# Altium project two_ax_PCB.PrjPcb
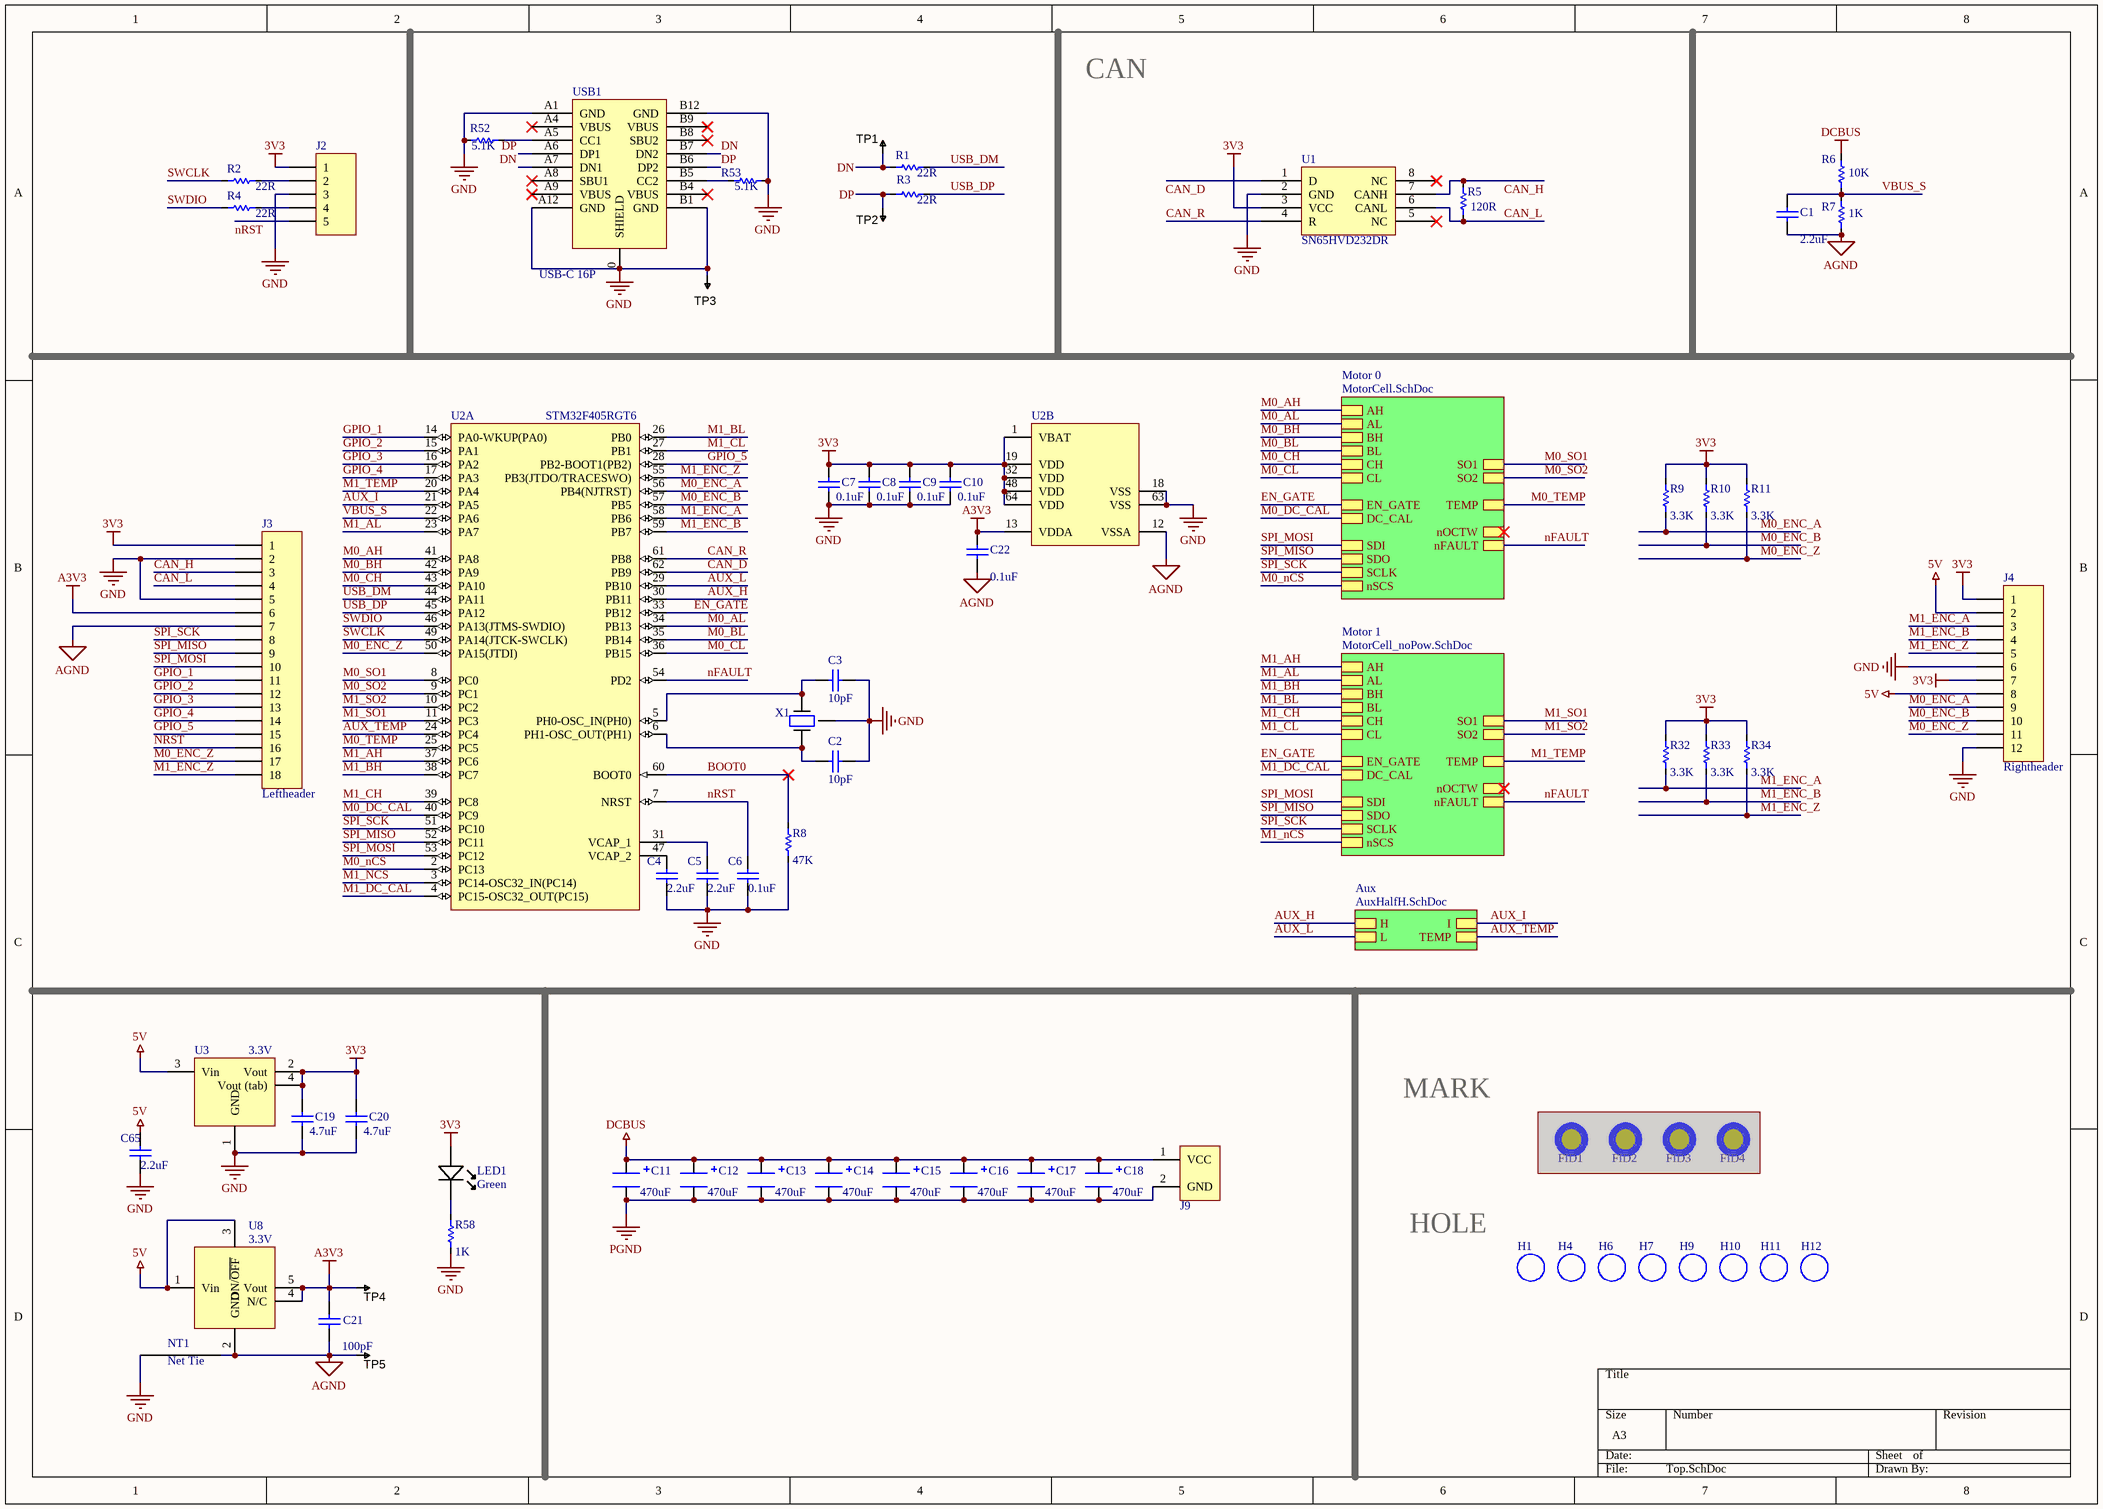
[diagram p0: Top.SchDoc]
4 sheets, 213 parts. Net scope: hierarchical (ports join the sheet entries above them; power ports are global).
Board file: PCB.PcbDoc
Sheets:
  Top.SchDoc
    Motor 0 = MotorCell.SchDoc
    Motor 1 = MotorCell_noPow.SchDoc
    Aux = AuxHalfH.SchDoc

## Sheet Top.SchDoc
size A3; SheetNumber: 1

### Parts
C1  value 2.2uF  [C0603]  (hidden comment: Cap)
C2  value 10pF  [C0603]  (hidden comment: Cap)
C3  value 10pF  [C0603]  (hidden comment: Cap)
C4  value 2.2uF  [C0603]  (hidden comment: Cap)
C5  value 2.2uF  [C0603]  (hidden comment: Cap)
C6  value 0.1uF  [C0603]  (hidden comment: Cap)
C7  value 0.1uF  [C0603]  (hidden comment: Cap)
C8  value 0.1uF  [C0603]  (hidden comment: Cap)
C9  value 0.1uF  [C0603]  (hidden comment: Cap)
C10  value 0.1uF  [C0603]  (hidden comment: Cap)
C11  470uF  [CAP_ELEC_SIZE_G]
C12  470uF  [CAP_ELEC_SIZE_G]
C13  470uF  [CAP_ELEC_SIZE_G]
C14  470uF  [CAP_ELEC_SIZE_G]
C15  470uF  [CAP_ELEC_SIZE_G]
C16  470uF  [CAP_ELEC_SIZE_G]
C17  470uF  [CAP_ELEC_SIZE_G]
C18  470uF  [CAP_ELEC_SIZE_G]
C19  value 4.7uF  [C0805]  (hidden comment: Cap)
C20  value 4.7uF  [C0805]  (hidden comment: Cap)
C21  value 100pF  [C0805]  (hidden comment: Cap)
C22  value 0.1uF  [C0603]  (hidden comment: Cap)
C65  value 2.2uF  [C0603]  (hidden comment: Cap)
FID1  FIDUCIAL  [FIDUCIAL]  (value not drawn)  (masked out: inside a compile mask, not in the netlist)
FID2  FIDUCIAL  [FIDUCIAL]  (value not drawn)  (masked out: inside a compile mask, not in the netlist)
FID3  FIDUCIAL  [FIDUCIAL]  (value not drawn)  (masked out: inside a compile mask, not in the netlist)
FID4  FIDUCIAL  [FIDUCIAL]  (value not drawn)  (masked out: inside a compile mask, not in the netlist)
H1  (no value)  [M3 Hole]
H4  (no value)  [M3 Hole]
H6  (no value)  [M3 Hole]
H7  (no value)  [M3 Hole]
H9  (no value)  [M3 Hole]
H10  (no value)  [M3 Hole]
H11  (no value)  [M3 Hole]
H12  (no value)  [M3 Hole]
J2  (no value)  [HDR1X5]
J3  Leftheader  [HDR1X18]
J4  Rightheader  [HDR1X12]
J9  XT60PB-M  [XT60PB-M]  (value not drawn)
LED1  Green  [LED-0603-GREEN]
NT1  (no value)  [NetTie_2mm]  (net tie, no BOM)
R1  value 22R  [R0603]  (hidden comment: Res)
R2  value 22R  [R0603]  (hidden comment: Res)
R3  value 22R  [R0603]  (hidden comment: Res)
R4  value 22R  [R0603]  (hidden comment: Res)
R5  value 120R  [R0603]  (hidden comment: Res)
R6  value 10K  [R0603]  (hidden comment: Res)
R7  value 1K  [R0603]  (hidden comment: Res)
R8  value 47K  [R0603]  (hidden comment: Res)
R9  value 3.3K  [R0603]  (hidden comment: Res)
R10  value 3.3K  [R0603]  (hidden comment: Res)
R11  value 3.3K  [R0603]  (hidden comment: Res)
R32  value 3.3K  [R0603]  (hidden comment: Res)
R33  value 3.3K  [R0603]  (hidden comment: Res)
R34  value 3.3K  [R0603]  (hidden comment: Res)
R52  value 5.1K  [R0402]  (hidden comment: Res)
R53  value 5.1K  [R0402]  (hidden comment: Res)
R58  value 1K  [R0603]  (hidden comment: Res)
TP1  TESTPOINT  [TP-R60]  (value not drawn)  (no BOM)
TP2  TESTPOINT  [TP-R60]  (value not drawn)  (no BOM)
TP3  TESTPOINT  [TP-R60]  (value not drawn)  (no BOM)
TP4  TESTPOINT  [TP-R30]  (value not drawn)  (no BOM)
TP5  TESTPOINT  [TP-R30]  (value not drawn)  (no BOM)
U1  Manufacturer Part Number: SN65HVD232DR  [SOIC127P600X175-8N]  (hidden comment: SN65HVD232D)
U2  (no value)  [STM-LQFP64_N]  (parts A,B of 2)
U3  3.3V  [SOT223]
U8  3.3V  [SOT23-5]
USB1  USB-C 16P  [USB-C-16P]
X1  X3225  [CRYSTAL_3225]  (value not drawn)

### Sub-sheets
Aux = AuxHalfH.SchDoc: H, L, I, TEMP
Motor 0 = MotorCell.SchDoc: nFAULT, nOCTW, EN_GATE, DC_CAL, SDI, SDO, SCLK, nSCS, SO1, SO2, AH, AL, BH, BL, CH, CL, TEMP
Motor 1 = MotorCell_noPow.SchDoc: nFAULT, nOCTW, EN_GATE, DC_CAL, SDI, SDO, SCLK, nSCS, SO1, SO2, AH, AL, BH, BL, CH, CL, TEMP

### Nets
3V3: C7.2 C8.2 C9.2 C10.2 C19.2 C20.2 J2.1 J3.1 J4.1 J4.7 LED1.A R9.2 R10.2 R11.2 R32.2 R33.2 R34.2 U1.3(VCC) U2.1(VBAT) U2.19(VDD) U2.32(VDD) U2.48(VDD) U2.64(VDD) U3.2(Vout) U3.4(Vout_(tab))
5V: C65.2 J4.2 J4.8 U3.3(Vin) U8.1(Vin) U8.3(ON/~{OFF})
A3V3: C21.2 C22.2 J3.6 TP4.1 U2.13(VDDA) U8.4(N/C) U8.5(Vout)
AGND: C1.1 C21.1 C22.1 J3.7 NT1.2 R7.1 TP5.1 U2.12(VSSA) U8.2(GND)
DCBUS: C11.1 C12.1 C13.1 C14.1 C15.1 C16.1 C17.1 C18.1 J9.1(VCC) R6.2
GND: C2.1 C3.1 C4.1 C5.1 C6.1 C7.1 C8.1 C9.1 C10.1 C19.1 C20.1 C65.1 J2.3 J3.2 J3.5 J4.6 J4.12 NT1.1 R8.1 R52.1 R53.2 R58.1 TP3.1 U1.2(GND) U2.18(VSS) U2.63(VSS) U3.1(GND) USB1.0(SHIELD) USB1.A1(GND) USB1.A12(GND) USB1.B1(GND) USB1.B12(GND) X1.G
PGND: C11.2 C12.2 C13.2 C14.2 C15.2 C16.2 C17.2 C18.2 J9.2(GND)
AUX_H: U2.30(PB11) ; sheet Aux/H
AUX_I: U2.21(PA5) ; sheet Aux/I
AUX_L: U2.29(PB10) ; sheet Aux/L
AUX_TEMP: U2.24(PC4) ; sheet Aux/TEMP
BOOT0: R8.2 U2.60(BOOT0)  [project net BOOT0_1]
CAN_D: U1.1(D) U2.62(PB9)  [project net CAN_D_1]
CAN_H: J3.3 R5.2 U1.7(CANH)  [project net CAN_H_1]
CAN_L: J3.4 R5.1 U1.6(CANL)  [project net CAN_L_1]
CAN_R: U1.4(R) U2.61(PB8)  [project net CAN_R_1]
DN: R1.2 TP1.1 USB1.A7(DN1) USB1.B7(DN2)  [project net DN_1]
DP: R3.2 TP2.1 USB1.A6(DP1) USB1.B6(DP2)  [project net DP_1]
EN_GATE: U2.33(PB12) ; sheet Motor 0/EN_GATE, sheet Motor 1/EN_GATE
GPIO_1: J3.11 U2.14(PA0-WKUP(PA0))  [project net GPIO_1_1]
GPIO_2: J3.12 U2.15(PA1)  [project net GPIO_2_1]
GPIO_3: J3.13 U2.16(PA2)  [project net GPIO_3_1]
GPIO_4: J3.14 U2.17(PA3)  [project net GPIO_4_1]
GPIO_5: J3.15 U2.28(PB2-BOOT1(PB2))  [project net GPIO_5_1]
M0_AH: U2.41(PA8) ; sheet Motor 0/AH
M0_AL: U2.34(PB13) ; sheet Motor 0/AL
M0_BH: U2.42(PA9) ; sheet Motor 0/BH
M0_BL: U2.35(PB14) ; sheet Motor 0/BL
M0_CH: U2.43(PA10) ; sheet Motor 0/CH
M0_CL: U2.36(PB15) ; sheet Motor 0/CL
M0_DC_CAL: U2.40(PC9) ; sheet Motor 0/DC_CAL
M0_ENC_A: J4.9 R9.1 U2.56(PB4(NJTRST))  [project net M0_ENC_A_1]
M0_ENC_B: J4.10 R10.1 U2.57(PB5)  [project net M0_ENC_B_1]
M0_ENC_Z: J3.17 J4.11 R11.1 U2.50(PA15(JTDI))  [project net M0_ENC_Z_1]
M0_nCS: U2.2(PC13) ; sheet Motor 0/nSCS
M0_SO1: U2.8(PC0) ; sheet Motor 0/SO1
M0_SO2: U2.9(PC1) ; sheet Motor 0/SO2
M0_TEMP: U2.25(PC5) ; sheet Motor 0/TEMP
M1_AH: U2.37(PC6) ; sheet Motor 1/AH
M1_AL: U2.23(PA7) ; sheet Motor 1/AL
M1_BH: U2.38(PC7) ; sheet Motor 1/BH
M1_BL: U2.26(PB0) ; sheet Motor 1/BL
M1_CH: U2.39(PC8) ; sheet Motor 1/CH
M1_CL: U2.27(PB1) ; sheet Motor 1/CL
M1_DC_CAL: U2.4(PC15-OSC32_OUT(PC15)) ; sheet Motor 1/DC_CAL
M1_ENC_A: J4.3 R32.1 U2.58(PB6)  [project net M1_ENC_A_1]
M1_ENC_B: J4.4 R33.1 U2.59(PB7)  [project net M1_ENC_B_1]
M1_ENC_Z: J3.18 J4.5 R34.1 U2.55(PB3(JTDO/TRACESWO))  [project net M1_ENC_Z_1]
M1_nCS: U2.3(PC14-OSC32_IN(PC14)) ; sheet Motor 1/nSCS
M1_SO1: U2.11(PC3) ; sheet Motor 1/SO1
M1_SO2: U2.10(PC2) ; sheet Motor 1/SO2
M1_TEMP: U2.20(PA4) ; sheet Motor 1/TEMP
nFAULT: U2.54(PD2) ; sheet Motor 0/nFAULT, sheet Motor 1/nFAULT
nRST: C6.2 J2.5 J3.16 U2.7(NRST)  [project net nRST_1]
SPI_MISO: J3.9 U2.52(PC11) ; sheet Motor 0/SDO, sheet Motor 1/SDO
SPI_MOSI: J3.10 U2.53(PC12) ; sheet Motor 0/SDI, sheet Motor 1/SDI
SPI_SCK: J3.8 U2.51(PC10) ; sheet Motor 0/SCLK, sheet Motor 1/SCLK
SWCLK: R2.2 U2.49(PA14(JTCK-SWCLK))  [project net SWCLK_1]
SWDIO: R4.2 U2.46(PA13(JTMS-SWDIO))  [project net SWDIO_1]
USB_DM: R1.1 U2.44(PA11)  [project net USB_DM_1]
USB_DP: R3.1 U2.45(PA12)  [project net USB_DP_1]
VBUS_S: C1.2 R6.1 R7.2 U2.22(PA6)  [project net VBUS_S_1]
NetC2_2: C2.2 U2.6(PH1-OSC_OUT(PH1)) X1.1
NetC3_2: C3.2 U2.5(PH0-OSC_IN(PH0)) X1.3
NetC4_2: C4.2 U2.47(VCAP_2)
NetC5_2: C5.2 U2.31(VCAP_1)
NetJ2_2: J2.2 R2.1
NetJ2_4: J2.4 R4.1
NetLED1_K: LED1.K R58.2
NetR52_2: R52.2 USB1.A5(CC1)
NetR53_1: R53.1 USB1.B5(CC2)

Not connected (* = marked no-connect by the designer): U1 5(NC)* 8(NC)*; USB1 A4(VBUS)* A8(SBU1)* A9(VBUS)* B4(VBUS)* B8(SBU2)* B9(VBUS)*

### Notes on the sheet
- CAN
- MARK
- HOLE
- (in symbol NetTie_2mm) Net Tie

### Library data of the parts
C1-C10 C22 = Cap: Capacitor; Published: 8-Jun-2000; LatestRevisionDate: 17-Jul-2002; LatestRevisionNote: Re-released for DXP Platform.; PackageReference: RAD-0.3; Publisher: Altium Limited; PackageDescription: Radial Cap, Thru-Hole; 2 Leads; 0.3 in Pin Spacing
C11-C18 = EEEFP1E471AP: CAP, FP Series, 470 µF, 25 V, Radial Can - SMD, 10 mm; Manufacturer: Panasonic Electronic Components; Manufacturer Part Number: EEE-FP1E471AP; Tolerance: ±20%; ESR (Equivalent Series Resistance): 60 mOhm @ 100kHz; Lifetime @ Temp.: 2000 Hrs @ 105°C; Polarization: Polar; Ripple Current - Low Frequency: 773.5mA @ 120Hz; Ripple Current - High Frequency: 1.19A @ 100kHz; Surface Mount Land Size: 0.406" L x 0.406" W (10.30mm x 10.30mm); Value: 470uF; Supplier 1: Digi-Key; Supplier Part Number 1: PCE4440TR-ND; RoHS: RoHS Compliant; Category: Capacitors; Stock: 8000; Pricing 1: 500=0.3571, 1000=0.30072, 2500=0.28192, 5000=0.26313, 12500=0.24997, 25000=0.24434 (USD); Packaging: Tape & Reel (TR); Part Status: Active; Operating Temperature: -55°C ~ 105°C; Applications: Automotive; Lead Spacing: -; Size / Dimension: 0.394" Dia (10.00mm); Height - Seated (Max): 0.402" (10.20mm); Mounting Type: Surface Mount; Package / Case: Radial, Can - SMD; ComponentLink1URL: http://industrial.panasonic.com/www-cgi/jvcr13pz.cgi?E+PZ+3+ABA0114+EEEFP1E471AP+7+WW; ComponentLink1Description: http://industrial.panasonic.com/www-cgi/jvcr13pz.cgi?E+PZ+3+ABA0114+EEEFP1E471AP+7+WW; Supplier 2: Digi-Key; Supplier Part Number 2: PCE4440CT-ND; Pricing 2: 1=0.92, 10=0.702, 100=0.5025 (USD)
C19-C21 = Cap: CAP CER 4.7UF 35V X5R 0805; Published: 8-Jun-2000; LatestRevisionDate: 17-Jul-2002; LatestRevisionNote: Re-released for DXP Platform.; PackageReference: RAD-0.3; Publisher: Altium Limited; PackageDescription: Radial Cap, Thru-Hole; 2 Leads; 0.3 in Pin Spacing
C65 = Cap: CAP CER 2.2UF 16V X5R 0603; Published: 8-Jun-2000; LatestRevisionDate: 17-Jul-2002; LatestRevisionNote: Re-released for DXP Platform.; PackageReference: RAD-0.3; Publisher: Altium Limited; PackageDescription: Radial Cap, Thru-Hole; 2 Leads; 0.3 in Pin Spacing
FID1-FID4 = FIDUCIAL: 1mm Fiducial with 2mm soldermask, 3mm keepout
H1 H4 H6 H7 H9-H12 = M3 Hole: M3 Hole with no copper
J2 = Header 5: Header, 5-Pin; LatestRevisionDate: 17-Jul-2002; LatestRevisionNote: Re-released for DXP Platform.; Publisher: Altium Limited
J3 = Header 18: Header, 18-Pin; LatestRevisionDate: 17-Jul-2002; LatestRevisionNote: Re-released for DXP Platform.; Publisher: Altium Limited
J4 = Header 12: Header, 12-Pin; LatestRevisionDate: 17-Jul-2002; LatestRevisionNote: Re-released for DXP Platform.; Publisher: Altium Limited
LED1 = LTST-C190KGKT: LED GREEN CLEAR 0603 SMD; Manufacturer: Lite-On Inc.; Lens Color: Colorless; Millicandela Rating: 35mcd; Lens Style/Size: Rectangle with Flat Top, 1.10mm x 0.80mm; Voltage - Forward (Vf) (Typ): 2V; Current - Test: 20mA; Viewing Angle: 130°; Wavelength - Dominant: 571nm; Wavelength - Peak: 574nm; Supplier 1: Digi-Key; Supplier Part Number 1: 160-1435-1-ND; RoHS: RoHS Compliant; Category: Optoelectronics; Stock: 922756; Pricing 1: 1=0.27, 10=0.196, 25=0.1448, 100=0.1034, 250=0.07032, 500=0.06204, 1000=0.0486 (USD); Packaging: Cut Tape (CT); Part Status: Active; Color: Green; Lens Transparency: Clear; Mounting Type: Surface Mount; Features: -; Package / Case: 0603 (1608 Metric); Size / Dimension: 1.60mm L x 0.80mm W; Height (Max): 0.80mm; ComponentLink1URL: http://optoelectronics.liteon.com/upload/download/DS22-2000-074/S_110_LTST-C190KGKT.pdf; ComponentLink1Description: http://optoelectronics.liteon.com/upload/download/DS22-2000-074/S_110_LTST-C190KGKT.pdf; Manufacturer Part Number: LTST-C190KGKT
NT1 = NetTie_2mm
R1-R11 R32-R34 R52 R53 R58 = Res: Resistor; Published: 8-Jun-2000; LatestRevisionDate: 17-Jul-2002; LatestRevisionNote: Re-released for DXP Platform.; PackageReference: AXIAL-0.3; Publisher: Altium Limited; PackageDescription: Axial Device, Thru-Hole; 2 Leads; 0.3 in Pin Spacing
TP1-TP5 = TESTPOINT: SMD test pin
U1 = SN65HVD232D: Manufacturer: Texas Instruments; Protocol: CAN; Number of Drivers/Receivers: 1/1; Duplex: Half; Data Rate: 1Mbps; Voltage - Supply: 3 V ~ 3.6 V; Supplier 1: Digi-Key; Supplier Part Number 1: 296-26344-2-ND; RoHS: RoHS Compliant; Category: Integrated Circuits (ICs); Stock: 5000; Pricing 1: 2500=0.84375 (USD); Packaging: Tape & Reel (TR); Part Status: Active; Type: Transceiver; Operating Temperature: -40°C ~ 85°C; Mounting Type: Surface Mount; Package / Case: 8-SOIC (0.154", 3.90mm Width); Supplier Device Package: 8-SOIC; ComponentLink1URL: http://www.ti.com/lit/ds/symlink/sn65hvd230.pdf; ComponentLink1Description: http://www.ti.com/lit/ds/symlink/sn65hvd230.pdf; Supplier 2: Digi-Key; Supplier Part Number 2: 296-26344-1-ND; Pricing 2: 1=2.05, 10=1.842, 100=1.4809, 500=1.21668, 1000=1.00811 (USD)
U2 = STM32F405RGT6: ARM Cortex-M4 32-bit MCU+FPU, 210 DMIPS, 1024 kB Flash, 192 kB Internal RAM, 51 I/Os, 64-pin LQFP, -40 to 85 degC, Tray; Manufacturer: STMicroelectronics; D/A Converter: 2x12-bit; FLASH Size (Prog) (kB): 1024; I/Os (High Current): 51; Internal RAM Size (kB): 192; Operating Frequency(F) (Processor speed) (MHz): 168; Supply Voltage(Vcc) max (V): 3.6; Supply Voltage(Vcc) min (V): 1.8; DatasheetVersion: Rev. 4; PackageVersion: Rev. 4, 06/2013; PackageReference: LQFP64; PackageDescription: 64-Pin Low Profile Quad Flat Package, 10 x 10 mm Body, 0.5 mm Pitch; Supplier 1: Digi-Key; Supplier Part Number 1: 497-11767-ND; Supplier 2: Farnell; Supplier Part Number 2: 2064363; Supplier 3: Newark; Supplier Part Number 3: 73T2329; Supplier 4: Mouser; Supplier Part Number 4: 511-STM32F405RGT6; Core: ARM Cortex-M4; Packing: Tray; Mounting Technology: Surface Mount; PartNumber: STM32F405RGT6; ComponentLink1Description: Manufacturer URL; ComponentLink1URL: http://www.st.com/web/en/home.html; ComponentLink2Description: Datasheet; ComponentLink2URL: http://www.st.com/st-web-ui/static/active/en/resource/technical/document/datasheet/DM00037051.pdf; ComponentLink3Description: Package Specification; ComponentLink3URL: http://www.st.com/st-web-ui/static/active/en/resource/technical/document/datasheet/DM00037051.pdf
U3 = AZ1117EH-3.3TRG1: IC REG LDO 3.3V 1A SOT223; Manufacturer: Diodes Incorporated; Regulator Topology: Positive Fixed; Voltage - Dropout (Typical): 1.1V @ 1A; Voltage - Input: Up to 13V; Supplier 1: Digi-Key; Supplier Part Number 1: AZ1117EH-3.3TRG1DICT-ND; RoHS: RoHS Compliant; Category: Integrated Circuits (ICs); Stock 1: 22748; Pricing 1: 1=0.43, 10=0.321, 100=0.1815, 500=0.12022, 1000=0.09216 (USD); Packaging: Cut Tape (CT); Part Status: Active; Voltage - Output: 3.3V; Current - Output: 1A; Current - Limit (Min): -; Operating Temperature: -40°C ~ 125°C; Mounting Type: Surface Mount; Package / Case: TO-261-4, TO-261AA; Supplier Device Package: SOT-223; ComponentLink1URL: http://www.diodes.com/assets/Datasheets/AZ1117E.pdf; ComponentLink1Description: http://www.diodes.com/assets/Datasheets/AZ1117E.pdf
U8 = LP5907MFX-3.3/NOPB: IC REG LDO 3.3V 0.25A SOT23-5; Manufacturer: Texas Instruments; Regulator Topology: Positive Fixed; Current - Output: 250mA; Voltage - Input: Up to 5.5V; Supplier 1: Digi-Key; Supplier Part Number 1: 296-38557-1-ND; RoHS: RoHS Compliant; Category: Integrated Circuits (ICs); Stock 1: 39845; Pricing 1: 1=0.57, 10=0.487, 100=0.3634, 500=0.28552, 1000=0.22063 (USD); Packaging: Cut Tape (CT); Part Status: Active; Voltage - Output: 3.3V; Voltage - Dropout (Typical): -; Current - Limit (Min): -; Operating Temperature: -40°C ~ 125°C; Mounting Type: Surface Mount; Package / Case: SC-74A, SOT-753; Supplier Device Package: SOT-23; ComponentLink1URL: http://www.ti.com/lit/ds/symlink/lp5907.pdf; ComponentLink1Description: http://www.ti.com/lit/ds/symlink/lp5907.pdf
X1 = X3225: Crystal 8MHz ±10ppm 10pF 200 Ohm -10°C ~ 60°C Surface Mount 4-SMD, No Lead (DFN, LCC); Manufacturer: Abracon LLC; Manufacturer Part Number: ABM3B-8.000MHZ-10-1-U-T; Operating Mode: Fundamental; Supplier 1: Digi-Key; Supplier Part Number 1: 535-9721-1-ND; RoHS: RoHS Compliant; Category: Crystals, Oscillators, Resonators; Stock: 35437; Pricing 1: 1=0.69, 10=0.578, 50=0.5198, 100=0.462, 500=0.4389 (USD); Packaging: Cut Tape (CT); Part Status: Active; Type: MHz Crystal; Frequency Stability: ±10ppm; Frequency Tolerance: ±10ppm; Load Capacitance: 10pF; Operating Temperature: -10°C ~ 60°C; Ratings: -; Mounting Type: Surface Mount; Package / Case: 4-SMD, No Lead; Size / Dimension: 0.197" L x 0.126" W (5.00mm x 3.20mm); Height - Seated (Max): 0.043" (1.10mm); ComponentLink1URL: http://www.abracon.com/Resonators/abm3b.pdf; ComponentLink1Description: http://www.abracon.com/Resonators/abm3b.pdf; Supplier 2: Digi-Key; Supplier Part Number 2: 535-9721-2-ND; Pricing 2: 1000=0.336, 3000=0.315, 5000=0.3045, 10000=0.294 (USD)

## Sheet MotorCell.SchDoc
size A3; SheetNumber: 2
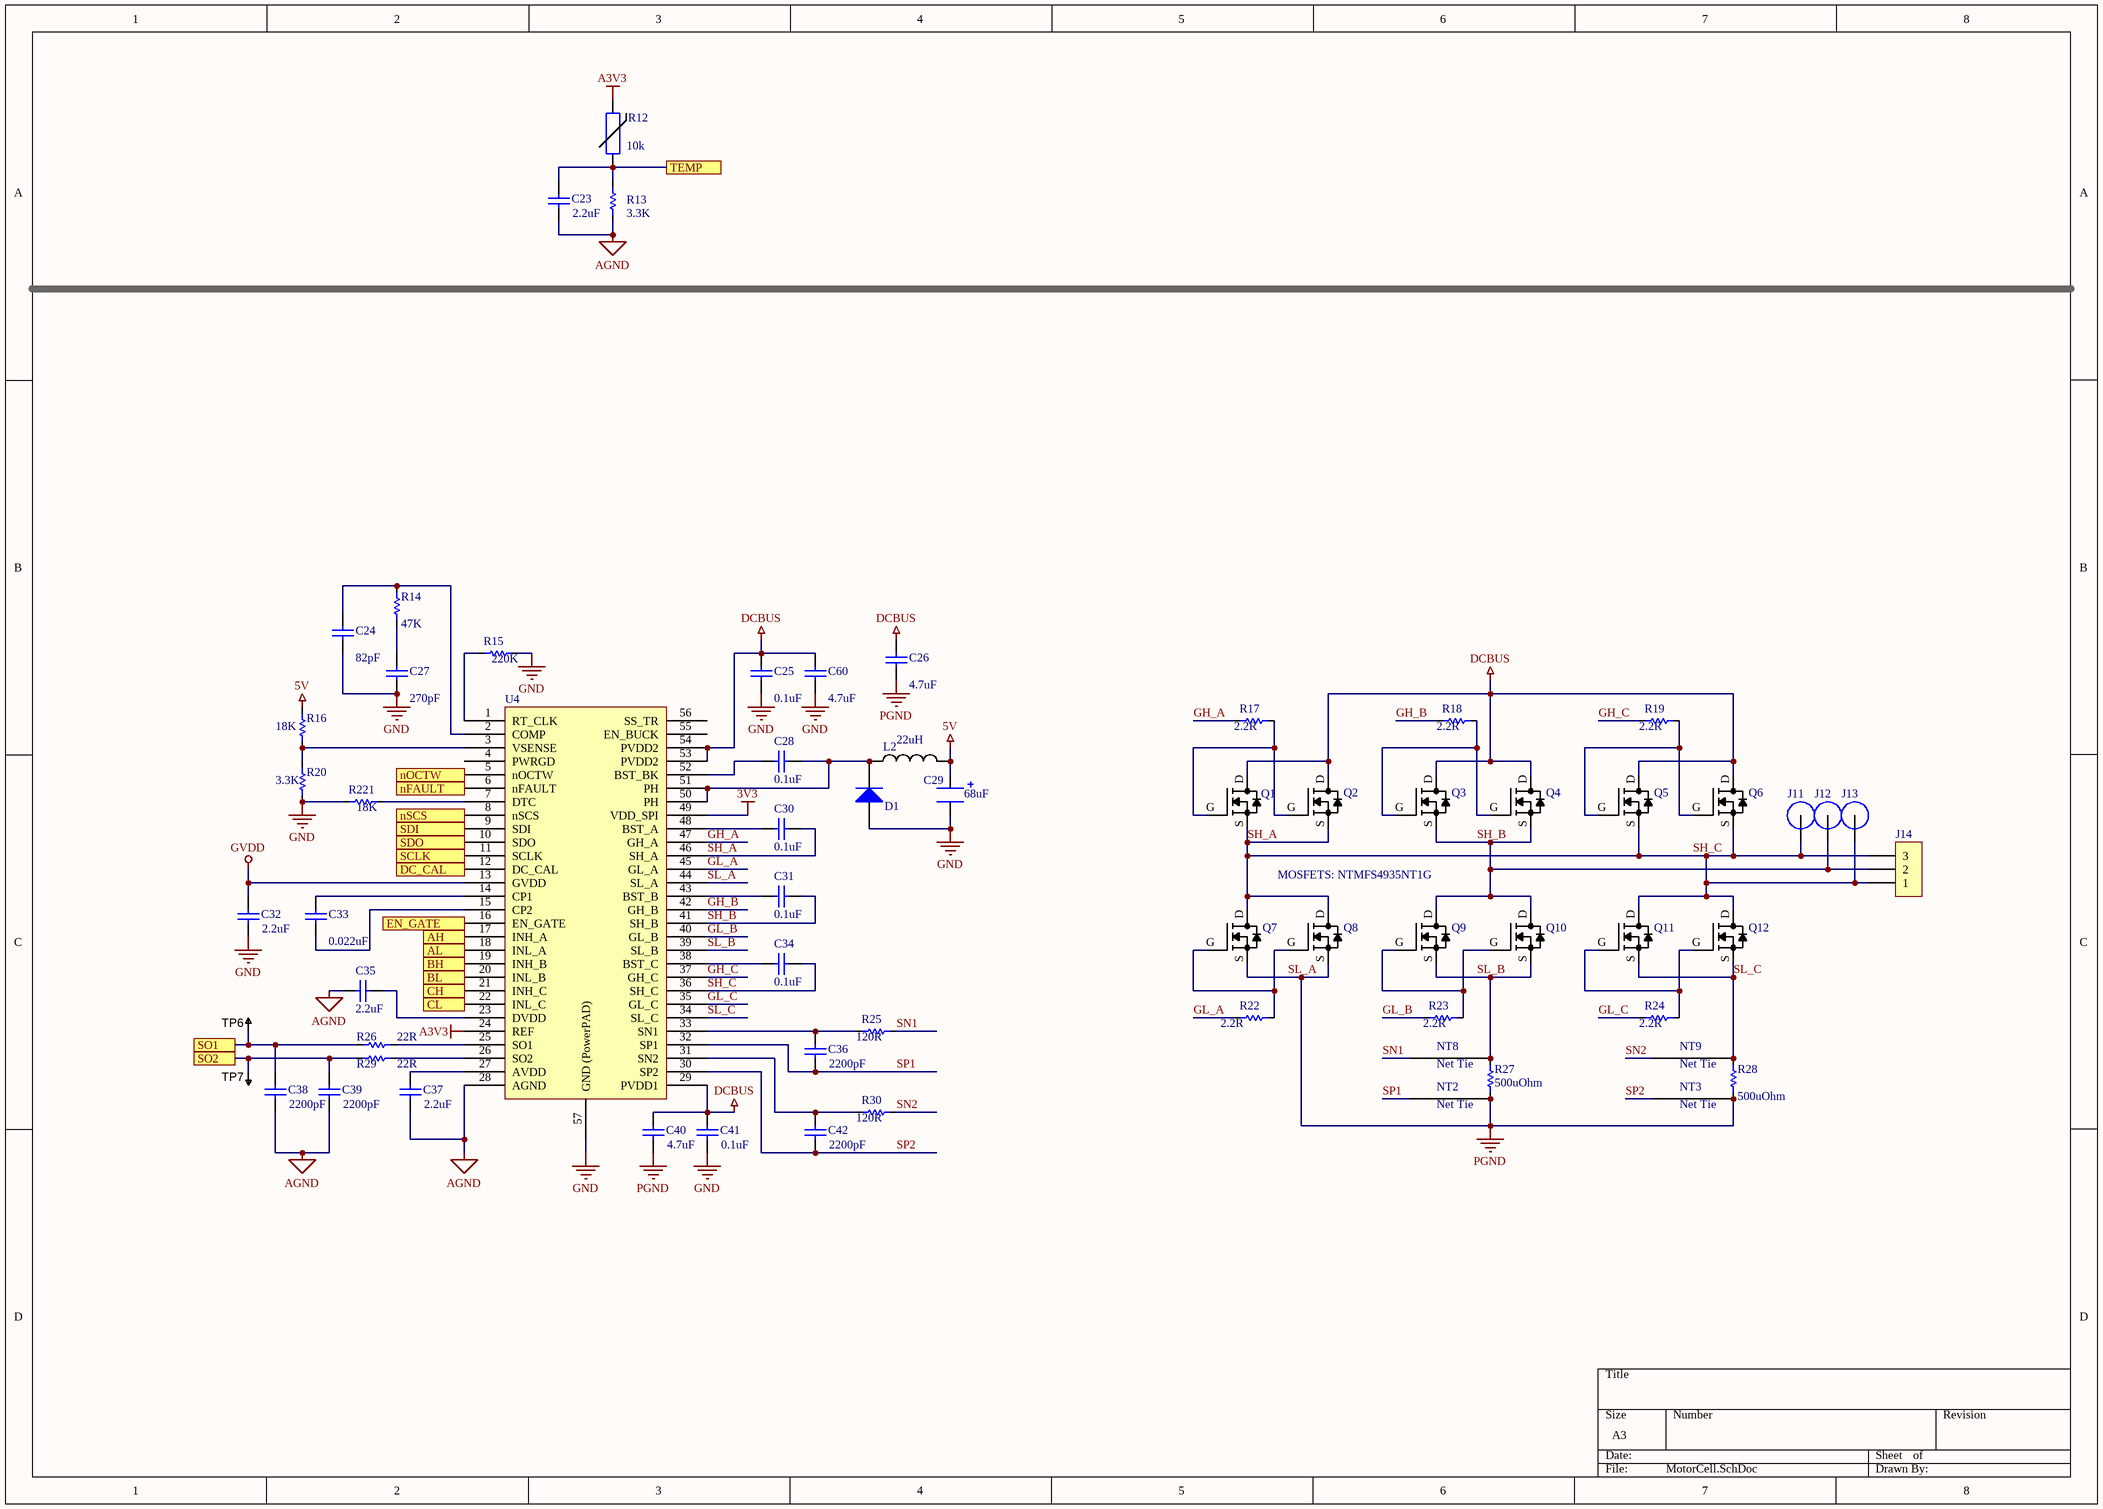
[diagram p1: MotorCell.SchDoc]

### Parts
C23  value 2.2uF  [C0603]  (hidden comment: Cap)
C24  value 82pF  [C0603]  (hidden comment: Cap)
C25  value 0.1uF  [C0603]  (hidden comment: Cap)
C26  value 4.7uF  [C0805]  (hidden comment: Cap)
C27  value 270pF  [C0603]  (hidden comment: Cap)
C28  value 0.1uF  [C0603]  (hidden comment: Cap)
C29  68uF  [CAPCP6032X28N]
C30  value 0.1uF  [C0603]  (hidden comment: Cap)
C31  value 0.1uF  [C0603]  (hidden comment: Cap)
C32  value 2.2uF  [C0603]  (hidden comment: Cap)
C33  value 0.022uF  [C0603]  (hidden comment: Cap)
C34  value 0.1uF  [C0603]  (hidden comment: Cap)
C35  value 2.2uF  [C0603]  (hidden comment: Cap)
C36  value 2200pF  [C0603]  (hidden comment: Cap)
C37  value 2.2uF  [C0603]  (hidden comment: Cap)
C38  value 2200pF  [C0603]  (hidden comment: Cap)
C39  value 2200pF  [C0603]  (hidden comment: Cap)
C40  value 4.7uF  [C0805]  (hidden comment: Cap)
C41  value 0.1uF  [C0603]  (hidden comment: Cap)
C42  value 2200pF  [C0603]  (hidden comment: Cap)
C60  value 4.7uF  [C0805]  (hidden comment: Cap)
D1  (no value)  [DIOM2717X10N]
J11  (no value)  [M3 Spade Hole]
J12  (no value)  [M3 Spade Hole]
J13  (no value)  [M3 Spade Hole]
J14  1704936  [1704936]  (value not drawn)
L2  22uH  [INDC6060X28N]
NT2  0.25mm  [NetTie_0.25mm]  (value not drawn)  (net tie, no BOM)
NT3  0.25mm  [NetTie_0.25mm]  (value not drawn)  (net tie, no BOM)
NT8  0.25mm  [NetTie_0.25mm]  (value not drawn)  (net tie, no BOM)
NT9  0.25mm  [NetTie_0.25mm]  (value not drawn)  (net tie, no BOM)
Q1  (no value)  [SO8FL]
Q2  FILL_FOOTPRINT  [SO8FL_FILL]  (value not drawn)
Q3  (no value)  [SO8FL]
Q4  FILL_FOOTPRINT  [SO8FL_FILL]  (value not drawn)
Q5  (no value)  [SO8FL]
Q6  FILL_FOOTPRINT  [SO8FL_FILL]  (value not drawn)
Q7  (no value)  [SO8FL]
Q8  (no value)  [SO8FL]
Q9  (no value)  [SO8FL]
Q10  (no value)  [SO8FL]
Q11  (no value)  [SO8FL]
Q12  (no value)  [SO8FL]
R12  10k  [RESC1005X40N]
R13  value 3.3K  [R0603]  (hidden comment: Res)
R14  value 47K  [R0603]  (hidden comment: Res)
R15  value 220K  [R0603]  (hidden comment: Res)
R16  value 18K  [R0603]  (hidden comment: Res)
R17  value 2.2R  [R0603]  (hidden comment: Res)
R18  value 2.2R  [R0603]  (hidden comment: Res)
R19  value 2.2R  [R0603]  (hidden comment: Res)
R20  value 3.3K  [R0603]  (hidden comment: Res)
R22  value 2.2R  [R0603]  (hidden comment: Res)
R23  value 2.2R  [R0603]  (hidden comment: Res)
R24  value 2.2R  [R0603]  (hidden comment: Res)
R25  value 120R  [R0603]  (hidden comment: Res)
R26  value 22R  [R0603]  (hidden comment: Res)
R27  value 500uOhm  [R2512]  (hidden comment: Res)
R28  value 500uOhm  [R2512]  (hidden comment: Res)
R29  value 22R  [R0603]  (hidden comment: Res)
R30  value 120R  [R0603]  (hidden comment: Res)
R221  value 18K  [R0603]  (hidden comment: Res)
TP6  TESTPOINT  [TP-R30]  (value not drawn)  (no BOM)
TP7  TESTPOINT  [TP-R30]  (value not drawn)  (no BOM)
U4  (no value)  [TSSOP50P810X120_HS-57N]

### Ports
AH, AL, BH, BL, CH, CL, DC_CAL, EN_GATE, nFAULT, nOCTW, nSCS, SCLK, SDI, SDO, SO1, SO2, TEMP

### Nets
3V3: U4.49(VDD_SPI)
5V: C29.1 L2.2 R16.1
A3V3: R12.2 U4.24(REF)
AGND: C23.1 C35.2 C37.1 C38.1 C39.1 R13.1 U4.28(AGND)
DCBUS: C25.2 C26.2 C40.2 C41.2 C60.2 Q1.D Q2.D Q3.D Q4.D Q5.D Q6.D U4.29(PVDD1) U4.53(PVDD2) U4.54(PVDD2)
GND: C24.1 C25.1 C27.1 C29.2 C32.1 C41.1 C60.1 D1.A R15.1 R20.2 R221.1 U4.57(GND_(PowerPAD))
GVDD: C32.2 U4.13(GVDD)
PGND: C26.1 C40.1 NT2.2 NT3.2 Q7.S Q8.S R27.2 R28.1 U4.44(SL_A)  [also labelled SL_A]
EN_GATE: U4.16(EN_GATE) ; port EN_GATE
GH_A: R17.2 U4.47(GH_A)  [project net GH_A_2]
GH_B: R18.2 U4.42(GH_B)  [project net GH_B_2]
GH_C: R19.2 U4.37(GH_C)  [project net GH_C_2]
GL_A: R22.2 U4.45(GL_A)  [project net GL_A_2]
GL_B: R23.2 U4.40(GL_B)  [project net GL_B_2]
GL_C: R24.2 U4.35(GL_C)  [project net GL_C_2]
M0_AH: U4.17(INH_A) ; port AH
M0_AL: U4.18(INL_A) ; port AL
M0_BH: U4.19(INH_B) ; port BH
M0_BL: U4.20(INL_B) ; port BL
M0_CH: U4.21(INH_C) ; port CH
M0_CL: U4.22(INL_C) ; port CL
M0_DC_CAL: U4.12(DC_CAL) ; port DC_CAL
M0_nCS: U4.8(nSCS) ; port nSCS
M0_SO1: C38.2 R26.1 TP6.1 ; port SO1
M0_SO2: C39.2 R29.1 TP7.1 ; port SO2
M0_TEMP: C23.2 R12.1 R13.2 ; port TEMP
nFAULT: U4.6(nFAULT) ; port nFAULT
SH_A: C30.1 C34.1 J11.1 J13.1 J14.1 J14.3 Q1.S Q2.S Q5.S Q6.S Q7.D Q8.D Q11.D Q12.D U4.36(SH_C) U4.46(SH_A)  [also labelled SH_C]  [project net SH_A_2]
SH_B: C31.1 J12.1 J14.2 Q3.S Q4.S Q9.D Q10.D U4.41(SH_B)  [project net SH_B_2]
SL_B: NT8.2 Q9.S Q10.S R27.1 U4.39(SL_B)  [project net SL_B_2]
SL_C: NT9.2 Q11.S Q12.S R28.2 U4.34(SL_C)  [project net SL_C_2]
SN1: NT8.1 R25.2  [project net SN1_2]
SN2: NT9.1 R30.2  [project net SN2_2]
SP1: C36.1 NT2.1 U4.32(SP1)  [project net SP1_2]
SP2: C42.1 NT3.1 U4.30(SP2)  [project net SP2_2]
SPI_MISO: U4.10(SDO) ; port SDO
SPI_MOSI: U4.9(SDI) ; port SDI
SPI_SCK: U4.11(SCLK) ; port SCLK
NetC24_2: C24.2 R14.1 U4.2(COMP)
NetC27_2: C27.2 R14.2
NetC28_1: C28.1 D1.K L2.1 U4.50(PH) U4.51(PH)
NetC28_2: C28.2 U4.52(BST_BK)
NetC30_2: C30.2 U4.48(BST_A)
NetC31_2: C31.2 U4.43(BST_B)
NetC33_1: C33.1 U4.15(CP2)
NetC33_2: C33.2 U4.14(CP1)
NetC34_2: C34.2 U4.38(BST_C)
NetC35_1: C35.1 U4.23(DVDD)
NetC36_2: C36.2 R25.1 U4.33(SN1)
NetC37_2: C37.2 U4.27(AVDD)
NetC42_2: C42.2 R30.1 U4.31(SN2)
NetQ1_G: Q1.G Q2.G R17.1
NetQ3_G: Q3.G Q4.G R18.1
NetQ5_G: Q5.G Q6.G R19.1
NetQ7_G: Q7.G Q8.G R22.1
NetQ9_G: Q9.G Q10.G R23.1
NetQ11_G: Q11.G Q12.G R24.1
NetR15_2: R15.2 U4.1(RT_CLK)
NetR16_2: R16.2 R20.1 U4.3(VSENSE)
NetR26_2: R26.2 U4.25(SO1)
NetR29_2: R29.2 U4.26(SO2)
NetR221_2: R221.2 U4.7(DTC)
NetU4_5: U4.5(nOCTW) ; port nOCTW

Not connected (* = marked no-connect by the designer): U4 4(PWRGD) 55(EN_BUCK) 56(SS_TR)

### Notes on the sheet
- MOSFETS: NTMFS4935NT1G
- (in symbol NetTie_0.25mm) Net Tie

### Library data of the parts
C23 C32 C35 C37 = Cap: CAP CER 2.2UF 16V X5R 0603; Published: 8-Jun-2000; LatestRevisionDate: 17-Jul-2002; LatestRevisionNote: Re-released for DXP Platform.; PackageReference: RAD-0.3; Publisher: Altium Limited; PackageDescription: Radial Cap, Thru-Hole; 2 Leads; 0.3 in Pin Spacing
C24 = Cap: CAP CER 82PF 100V NP0 0603; Published: 8-Jun-2000; LatestRevisionDate: 17-Jul-2002; LatestRevisionNote: Re-released for DXP Platform.; PackageReference: RAD-0.3; Publisher: Altium Limited; PackageDescription: Radial Cap, Thru-Hole; 2 Leads; 0.3 in Pin Spacing
C25 C28 C30 C31 C34 C41 = Cap: CAP CER 0.1UF 50V X7R 0603; Published: 8-Jun-2000; LatestRevisionDate: 17-Jul-2002; LatestRevisionNote: Re-released for DXP Platform.; PackageReference: RAD-0.3; Publisher: Altium Limited; PackageDescription: Radial Cap, Thru-Hole; 2 Leads; 0.3 in Pin Spacing
C26 C40 C60 = Cap: CAP CER 4.7UF 35V X5R 0805; Published: 8-Jun-2000; LatestRevisionDate: 17-Jul-2002; LatestRevisionNote: Re-released for DXP Platform.; PackageReference: RAD-0.3; Publisher: Altium Limited; PackageDescription: Radial Cap, Thru-Hole; 2 Leads; 0.3 in Pin Spacing
C27 = Cap: CAP CER 270PF 50V NP0 0603; Published: 8-Jun-2000; LatestRevisionDate: 17-Jul-2002; LatestRevisionNote: Re-released for DXP Platform.; PackageReference: RAD-0.3; Publisher: Altium Limited; PackageDescription: Radial Cap, Thru-Hole; 2 Leads; 0.3 in Pin Spacing
C29 = T495C686M016ATE250: CAP TANT 68UF 16V 20% 2312 250mOhm; Manufacturer: KEMET; Manufacturer Size Code: C; Type: Molded; Lifetime @ Temp.: 2000 Hrs @ 85°C; Value: 68uF; Supplier 1: Digi-Key; Supplier Part Number 1: 399-10452-1-ND; RoHS: RoHS Compliant; Category: Capacitors; Stock: 39507; Pricing 1: 1=0.98, 10=0.747, 100=0.5345 (USD); Packaging: Cut Tape (CT); Part Status: Active; Tolerance: ±20%; ESR (Equivalent Series Resistance): 250 mOhm; Operating Temperature: -55°C ~ 125°C; Mounting Type: Surface Mount; Package / Case: 2312 (6032 Metric); Size / Dimension: 0.236" L x 0.126" W (6.00mm x 3.20mm); Height - Seated (Max): 0.110" (2.80mm); Lead Spacing: -; Features: General Purpose; Failure Rate: -; ComponentLink1URL: https://search.kemet.com/component-edge/download/datasheet/T495C686M016ATE250.pdf; ComponentLink1Description: https://search.kemet.com/component-edge/download/datasheet/T495C686M016ATE250.pdf; Supplier 2: Digi-Key; Supplier Part Number 2: 399-10452-2-ND; Pricing 2: 500=0.35986, 1000=0.30988, 2500=0.28988, 5000=0.27608 (USD); Manufacturer Part Number: T495C686M016ATE250
C33 = Cap: CAP CER 0.022UF 50V X7R 0603; Published: 8-Jun-2000; LatestRevisionDate: 17-Jul-2002; LatestRevisionNote: Re-released for DXP Platform.; PackageReference: RAD-0.3; Publisher: Altium Limited; PackageDescription: Radial Cap, Thru-Hole; 2 Leads; 0.3 in Pin Spacing
C36 C38 C39 C42 = Cap: CAP CER 2200PF 50V NP0 0603; Published: 8-Jun-2000; LatestRevisionDate: 17-Jul-2002; LatestRevisionNote: Re-released for DXP Platform.; PackageReference: RAD-0.3; Publisher: Altium Limited; PackageDescription: Radial Cap, Thru-Hole; 2 Leads; 0.3 in Pin Spacing
D1 = MBR140SFT1G: Rectifier Diode, Single, 40 V, 1 A, SOD-123FL, 2, 550 mV
J11-J13 = M3 Spade Terminal
J14 = 1704936: CONN TERM BLOCK 3POS 7.62MM; Manufacturer: Phoenix Contact; Number of Levels: 1; Positions Per Level: 3; Pitch: 0.300" (7.62mm); Mating Orientation: Horizontal with Board; Current: 30A; Voltage: 300V; Wire Gauge: 10-30 AWG; Wire Termination: Screw - Rising Cage Clamp; Torque - Screw: 0.5-0.6 Nm (4.4-5.3 Lb-In); Screw Thread: M3; Supplier 1: Digi-Key; Supplier Part Number 1: 277-5954-ND; RoHS: RoHS Compliant; Category: Connectors, Interconnects; Stock: 3559; Pricing 1: 1=2.19, 10=2.128, 50=1.989, 100=1.8299, 250=1.69064, 500=1.61108, 1000=1.482 (USD); Packaging: Bulk; Part Status: Active; Mounting Type: Through Hole; Features: Interlocking (Side); Color: Green; Operating Temperature: -; Housing Material: Polyamide (PA), Nylon; Contact Material - Plating: -; Clamp Material - Plating: -; Screw Material - Plating: -; ComponentLink1URL: http://media.digikey.com/PDF/Data%20Sheets/Phoenix%20Contact%20PDFs/1704936.pdf; ComponentLink1Description: http://media.digikey.com/PDF/Data%20Sheets/Phoenix%20Contact%20PDFs/1704936.pdf; Manufacturer Part Number: 1704936
L2 = NR6028T220M: INDUCTOR 22UH 1.4A 175.5 MOHM; Value: 22uH
NT2 NT3 NT8 NT9 = NetTie_0.25mm
Q1-Q12 = NTMFS4935NT1G: MOSFET N-CH 30V 13A SO8FL; Manufacturer: ON Semiconductor; FET Type: N-Channel; Current - Continuous Drain (Id) @ 25°C: 13A (Ta), 93A (Tc); Drive Voltage (Max Rds On,  Min Rds On): 4.5V, 10V; Vgs(th) (Max) @ Id: 2.2V @ 250µA; Gate Charge (Qg) (Max) @ Vgs: 49.4nC @ 10V; Input Capacitance (Ciss) (Max) @ Vds: 4850pF @ 15V; Vgs (Max): ±20V; Power Dissipation (Max): 930mW (Ta), 48W (Tc); Rds On (Max) @ Id, Vgs: 3.2 mOhm @ 30A, 10V; Supplier 1: Digi-Key; Supplier Part Number 1: NTMFS4935NT1GOSCT-ND; RoHS: RoHS Compliant; Category: Discrete Semiconductor Products; Stock 1: 932; Pricing 1: 1=0.61, 10=0.541, 100=0.4145, 500=0.3277 (USD); Packaging: Cut Tape (CT); Part Status: Active; Technology: MOSFET (Metal Oxide); Drain to Source Voltage (Vdss): 30V; FET Feature: -; Operating Temperature: -55°C ~ 150°C (TJ); Mounting Type: Surface Mount; Supplier Device Package: 5-DFN (5x6) (8-SOFL); Package / Case: 8-PowerTDFN, 5 Leads; ComponentLink1URL: http://www.onsemi.com/pub_link/Collateral/NTMFS4935N-D.PDF; ComponentLink1Description: http://www.onsemi.com/pub_link/Collateral/NTMFS4935N-D.PDF; Manufacturer Part Number: NTMFS4935NT1G
R12 = NCP15XH103F03RC: THERMISTOR 10K OHM NTC 0402 SMD; Value: 10k
R13-R20 R22-R26 R29 R30 R221 = Res: Resistor; Published: 8-Jun-2000; LatestRevisionDate: 17-Jul-2002; LatestRevisionNote: Re-released for DXP Platform.; PackageReference: AXIAL-0.3; Publisher: Altium Limited; PackageDescription: Axial Device, Thru-Hole; 2 Leads; 0.3 in Pin Spacing
R27 R28 = Res: RES SMD 0.0005 OHM 1% 3W 2512; Published: 8-Jun-2000; LatestRevisionDate: 17-Jul-2002; LatestRevisionNote: Re-released for DXP Platform.; PackageReference: AXIAL-0.3; Publisher: Altium Limited; PackageDescription: Axial Device, Thru-Hole; 2 Leads; 0.3 in Pin Spacing
TP6 TP7 = TESTPOINT: SMD test pin
U4 = DRV8301: MOTOR DRIVER, 3PH, 56HTSSOP

## Sheet MotorCell_noPow.SchDoc
size A3; SheetNumber: 3
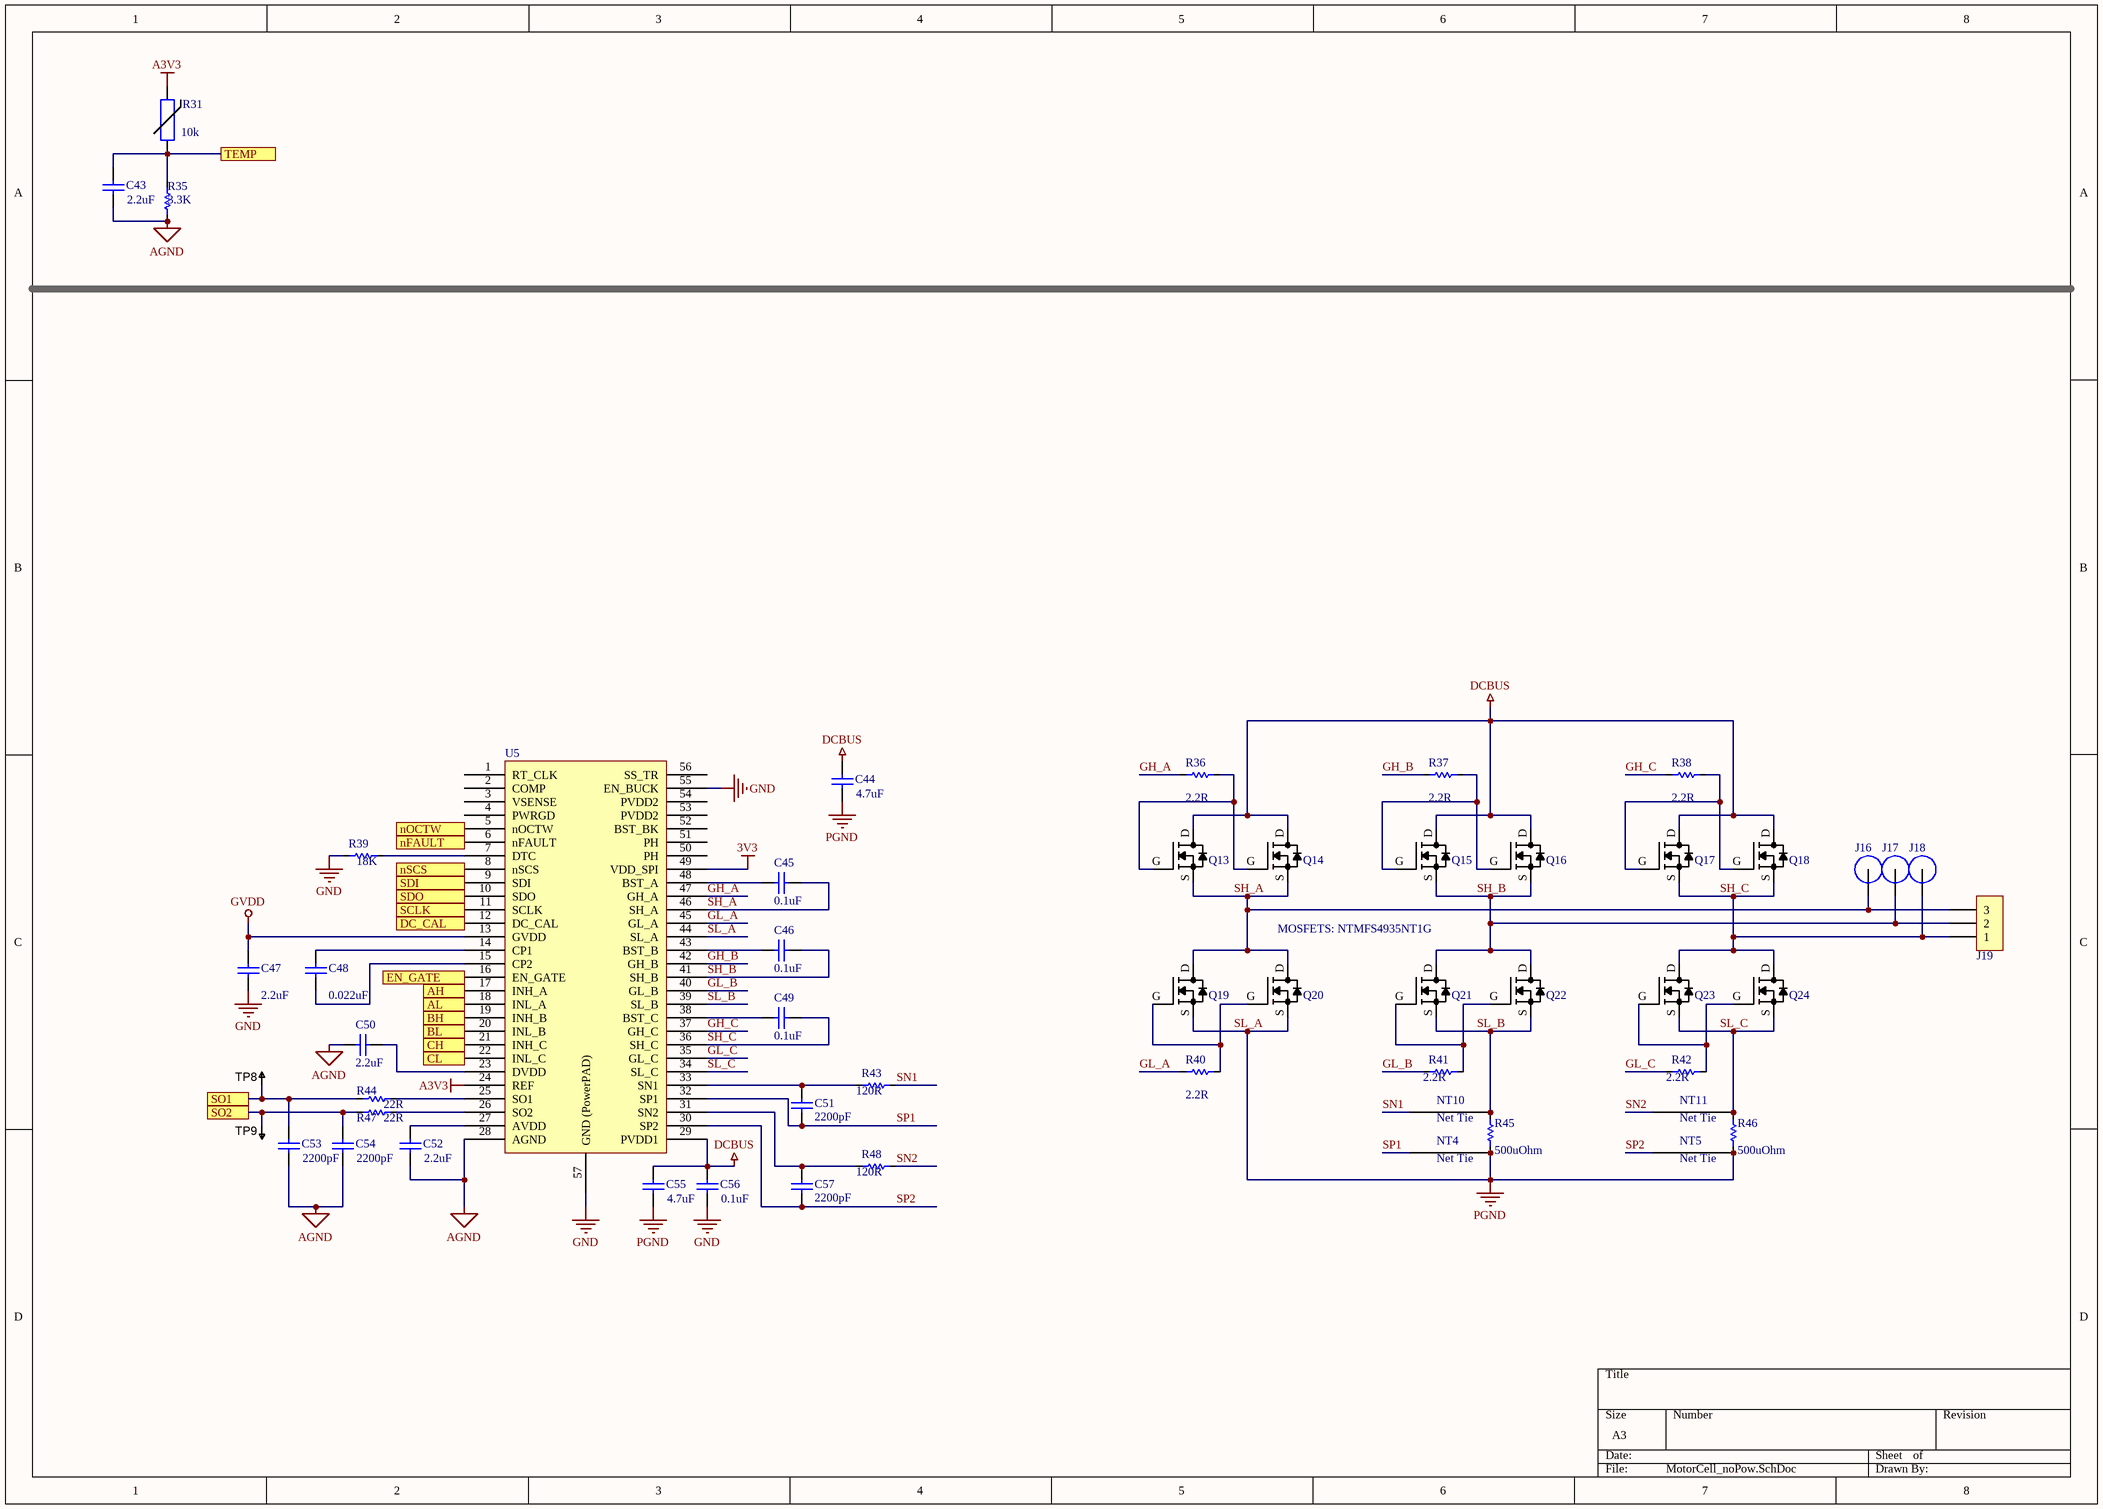
[diagram p2: MotorCell_noPow.SchDoc]

### Parts
C43  value 2.2uF  [C0603]  (hidden comment: Cap)
C44  value 4.7uF  [C0805]  (hidden comment: Cap)
C45  value 0.1uF  [C0603]  (hidden comment: Cap)
C46  value 0.1uF  [C0603]  (hidden comment: Cap)
C47  value 2.2uF  [C0603]  (hidden comment: Cap)
C48  value 0.022uF  [C0603]  (hidden comment: Cap)
C49  value 0.1uF  [C0603]  (hidden comment: Cap)
C50  value 2.2uF  [C0603]  (hidden comment: Cap)
C51  value 2200pF  [C0603]  (hidden comment: Cap)
C52  value 2.2uF  [C0603]  (hidden comment: Cap)
C53  value 2200pF  [C0603]  (hidden comment: Cap)
C54  value 2200pF  [C0603]  (hidden comment: Cap)
C55  value 4.7uF  [C0805]  (hidden comment: Cap)
C56  value 0.1uF  [C0603]  (hidden comment: Cap)
C57  value 2200pF  [C0603]  (hidden comment: Cap)
J16  (no value)  [M3 Spade Hole]
J17  (no value)  [M3 Spade Hole]
J18  (no value)  [M3 Spade Hole]
J19  1704936  [1704936]  (value not drawn)
NT4  0.25mm  [NetTie_0.25mm]  (value not drawn)  (net tie, no BOM)
NT5  0.25mm  [NetTie_0.25mm]  (value not drawn)  (net tie, no BOM)
NT10  0.25mm  [NetTie_0.25mm]  (value not drawn)  (net tie, no BOM)
NT11  0.25mm  [NetTie_0.25mm]  (value not drawn)  (net tie, no BOM)
Q13  (no value)  [SO8FL]
Q14  FILL_FOOTPRINT  [SO8FL_FILL]  (value not drawn)
Q15  (no value)  [SO8FL]
Q16  FILL_FOOTPRINT  [SO8FL_FILL]  (value not drawn)
Q17  (no value)  [SO8FL]
Q18  FILL_FOOTPRINT  [SO8FL_FILL]  (value not drawn)
Q19  (no value)  [SO8FL]
Q20  (no value)  [SO8FL]
Q21  (no value)  [SO8FL]
Q22  (no value)  [SO8FL]
Q23  (no value)  [SO8FL]
Q24  (no value)  [SO8FL]
R31  10k  [RESC1005X40N]
R35  value 3.3K  [R0603]  (hidden comment: Res)
R36  value 2.2R  [R0603]  (hidden comment: Res)
R37  value 2.2R  [R0603]  (hidden comment: Res)
R38  value 2.2R  [R0603]  (hidden comment: Res)
R39  value 18K  [R0603]  (hidden comment: Res)
R40  value 2.2R  [R0603]  (hidden comment: Res)
R41  value 2.2R  [R0603]  (hidden comment: Res)
R42  value 2.2R  [R0603]  (hidden comment: Res)
R43  value 120R  [R0603]  (hidden comment: Res)
R44  value 22R  [R0603]  (hidden comment: Res)
R45  value 500uOhm  [R2512]  (hidden comment: Res)
R46  value 500uOhm  [R2512]  (hidden comment: Res)
R47  value 22R  [R0603]  (hidden comment: Res)
R48  value 120R  [R0603]  (hidden comment: Res)
TP8  TESTPOINT  [TP-R30]  (value not drawn)  (no BOM)
TP9  TESTPOINT  [TP-R30]  (value not drawn)  (no BOM)
U5  (no value)  [TSSOP50P810X120_HS-57N]

### Ports
AH, AL, BH, BL, CH, CL, DC_CAL, EN_GATE, nFAULT, nOCTW, nSCS, SCLK, SDI, SDO, SO1, SO2, TEMP

### Nets
3V3: U5.49(VDD_SPI)
A3V3: R31.2 U5.24(REF)
AGND: C43.1 C50.2 C52.1 C53.1 C54.1 R35.1 U5.28(AGND)
DCBUS: C44.2 C55.2 C56.2 Q13.D Q14.D Q15.D Q16.D Q17.D Q18.D U5.29(PVDD1)
GND: C47.1 C56.1 R39.1 U5.55(EN_BUCK) U5.57(GND_(PowerPAD))
GVDD: C47.2 U5.13(GVDD)
PGND: C44.1 C55.1 NT4.2 NT5.2 Q19.S Q20.S R45.1 R46.1 U5.44(SL_A)  [also labelled SL_A]
EN_GATE: U5.16(EN_GATE) ; port EN_GATE
GH_A: R36.2 U5.47(GH_A)  [project net GH_A_3]
GH_B: R37.2 U5.42(GH_B)  [project net GH_B_3]
GH_C: R38.2 U5.37(GH_C)  [project net GH_C_3]
GL_A: R40.2 U5.45(GL_A)  [project net GL_A_3]
GL_B: R41.2 U5.40(GL_B)  [project net GL_B_3]
GL_C: R42.2 U5.35(GL_C)  [project net GL_C_3]
M1_AH: U5.17(INH_A) ; port AH
M1_AL: U5.18(INL_A) ; port AL
M1_BH: U5.19(INH_B) ; port BH
M1_BL: U5.20(INL_B) ; port BL
M1_CH: U5.21(INH_C) ; port CH
M1_CL: U5.22(INL_C) ; port CL
M1_DC_CAL: U5.12(DC_CAL) ; port DC_CAL
M1_nCS: U5.8(nSCS) ; port nSCS
M1_SO1: C53.2 R44.1 TP8.1 ; port SO1
M1_SO2: C54.2 R47.1 TP9.1 ; port SO2
M1_TEMP: C43.2 R31.1 R35.2 ; port TEMP
nFAULT: U5.6(nFAULT) ; port nFAULT
SH_A: C45.1 J16.1 J19.3 Q13.S Q14.S Q19.D Q20.D U5.46(SH_A)  [project net SH_A_3]
SH_B: C46.1 J17.1 J19.2 Q15.S Q16.S Q21.D Q22.D U5.41(SH_B)  [project net SH_B_3]
SH_C: C49.1 J18.1 J19.1 Q17.S Q18.S Q23.D Q24.D U5.36(SH_C)  [project net SH_C_3]
SL_B: NT10.2 Q21.S Q22.S R45.2 U5.39(SL_B)  [project net SL_B_3]
SL_C: NT11.2 Q23.S Q24.S R46.2 U5.34(SL_C)  [project net SL_C_3]
SN1: NT10.1 R43.2  [project net SN1_3]
SN2: NT11.1 R48.2  [project net SN2_3]
SP1: C51.2 NT4.1 U5.32(SP1)  [project net SP1_3]
SP2: C57.2 NT5.1 U5.30(SP2)  [project net SP2_3]
SPI_MISO: U5.10(SDO) ; port SDO
SPI_MOSI: U5.9(SDI) ; port SDI
SPI_SCK: U5.11(SCLK) ; port SCLK
NetC45_2: C45.2 U5.48(BST_A)
NetC46_2: C46.2 U5.43(BST_B)
NetC48_1: C48.1 U5.15(CP2)
NetC48_2: C48.2 U5.14(CP1)
NetC49_2: C49.2 U5.38(BST_C)
NetC50_1: C50.1 U5.23(DVDD)
NetC51_1: C51.1 R43.1 U5.33(SN1)
NetC52_2: C52.2 U5.27(AVDD)
NetC57_1: C57.1 R48.1 U5.31(SN2)
NetQ13_G: Q13.G Q14.G R36.1
NetQ15_G: Q15.G Q16.G R37.1
NetQ17_G: Q17.G Q18.G R38.1
NetQ19_G: Q19.G Q20.G R40.1
NetQ21_G: Q21.G Q22.G R41.1
NetQ23_G: Q23.G Q24.G R42.1
NetR39_2: R39.2 U5.7(DTC)
NetR44_2: R44.2 U5.25(SO1)
NetR47_2: R47.2 U5.26(SO2)
NetU5_5: U5.5(nOCTW) ; port nOCTW

Not connected (* = marked no-connect by the designer): U5 1(RT_CLK) 2(COMP) 3(VSENSE) 4(PWRGD) 50(PH) 51(PH) 52(BST_BK) 53(PVDD2) 54(PVDD2) 56(SS_TR)

### Notes on the sheet
- MOSFETS: NTMFS4935NT1G
- (in symbol NetTie_0.25mm) Net Tie

### Library data of the parts
C43 C44 C47 C50 = Cap: Capacitor; Published: 8-Jun-2000; LatestRevisionDate: 17-Jul-2002; LatestRevisionNote: Re-released for DXP Platform.; PackageReference: RAD-0.3; Publisher: Altium Limited; PackageDescription: Radial Cap, Thru-Hole; 2 Leads; 0.3 in Pin Spacing
C45 C46 C49 C56 = Cap: CAP CER 0.1UF 50V X7R 0603; Published: 8-Jun-2000; LatestRevisionDate: 17-Jul-2002; LatestRevisionNote: Re-released for DXP Platform.; PackageReference: RAD-0.3; Publisher: Altium Limited; PackageDescription: Radial Cap, Thru-Hole; 2 Leads; 0.3 in Pin Spacing
C48 = Cap: CAP CER 0.022UF 50V X7R 0603; Published: 8-Jun-2000; LatestRevisionDate: 17-Jul-2002; LatestRevisionNote: Re-released for DXP Platform.; PackageReference: RAD-0.3; Publisher: Altium Limited; PackageDescription: Radial Cap, Thru-Hole; 2 Leads; 0.3 in Pin Spacing
C51 C53 C54 C57 = Cap: CAP CER 2200PF 50V NP0 0603; Published: 8-Jun-2000; LatestRevisionDate: 17-Jul-2002; LatestRevisionNote: Re-released for DXP Platform.; PackageReference: RAD-0.3; Publisher: Altium Limited; PackageDescription: Radial Cap, Thru-Hole; 2 Leads; 0.3 in Pin Spacing
C52 = Cap: CAP CER 2.2UF 16V X5R 0603; Published: 8-Jun-2000; LatestRevisionDate: 17-Jul-2002; LatestRevisionNote: Re-released for DXP Platform.; PackageReference: RAD-0.3; Publisher: Altium Limited; PackageDescription: Radial Cap, Thru-Hole; 2 Leads; 0.3 in Pin Spacing
C55 = Cap: CAP CER 4.7UF 35V X5R 0805; Published: 8-Jun-2000; LatestRevisionDate: 17-Jul-2002; LatestRevisionNote: Re-released for DXP Platform.; PackageReference: RAD-0.3; Publisher: Altium Limited; PackageDescription: Radial Cap, Thru-Hole; 2 Leads; 0.3 in Pin Spacing
J16-J18 = M3 Spade Terminal
J19 = 1704936: as J14 on sheet MotorCell; Supplier 1: Digi-Key; Supplier Part Number 1: 277-5954-ND; RoHS: RoHS Compliant; Category: Connectors, Interconnects; Stock: 3559; Pricing 1: 1=2.19, 10=2.128, 50=1.989, 100=1.8299, 250=1.69064, 500=1.61108, 1000=1.482 (USD); Packaging: Bulk; Part Status: Active; Mounting Type: Through Hole; Features: Interlocking (Side); Color: Green; Operating Temperature: -; Housing Material: Polyamide (PA), Nylon; Contact Material - Plating: -; Clamp Material - Plating: -; Screw Material - Plating: -; ComponentLink1URL: http://media.digikey.com/PDF/Data%20Sheets/Phoenix%20Contact%20PDFs/1704936.pdf; ComponentLink1Description: http://media.digikey.com/PDF/Data%20Sheets/Phoenix%20Contact%20PDFs/1704936.pdf; Manufacturer Part Number: 1704936
NT4 NT5 NT10 NT11 = NetTie_0.25mm
Q13-Q24 = NTMFS4935NT1G: as Q1 on sheet MotorCell; Supplier 1: Digi-Key; Supplier Part Number 1: NTMFS4935NT1GOSCT-ND; RoHS: RoHS Compliant; Category: Discrete Semiconductor Products; Stock 1: 932; Pricing 1: 1=0.61, 10=0.541, 100=0.4145, 500=0.3277 (USD); Packaging: Cut Tape (CT); Part Status: Active; Technology: MOSFET (Metal Oxide); Drain to Source Voltage (Vdss): 30V; FET Feature: -; Operating Temperature: -55°C ~ 150°C (TJ); Mounting Type: Surface Mount; Supplier Device Package: 5-DFN (5x6) (8-SOFL); Package / Case: 8-PowerTDFN, 5 Leads; ComponentLink1URL: http://www.onsemi.com/pub_link/Collateral/NTMFS4935N-D.PDF; ComponentLink1Description: http://www.onsemi.com/pub_link/Collateral/NTMFS4935N-D.PDF; Manufacturer Part Number: NTMFS4935NT1G
R31 = NCP15XH103F03RC: THERMISTOR 10K OHM NTC 0402 SMD; Value: 10k
R35-R44 R47 R48 = Res: Resistor; Published: 8-Jun-2000; LatestRevisionDate: 17-Jul-2002; LatestRevisionNote: Re-released for DXP Platform.; PackageReference: AXIAL-0.3; Publisher: Altium Limited; PackageDescription: Axial Device, Thru-Hole; 2 Leads; 0.3 in Pin Spacing
R45 R46 = Res: RES SMD 0.0005 OHM 1% 3W 2512; Published: 8-Jun-2000; LatestRevisionDate: 17-Jul-2002; LatestRevisionNote: Re-released for DXP Platform.; PackageReference: AXIAL-0.3; Publisher: Altium Limited; PackageDescription: Axial Device, Thru-Hole; 2 Leads; 0.3 in Pin Spacing
TP8 TP9 = TESTPOINT: SMD test pin
U5 = DRV8301: MOTOR DRIVER, 3PH, 56HTSSOP

## Sheet AuxHalfH.SchDoc
size A3; SheetNumber: 4
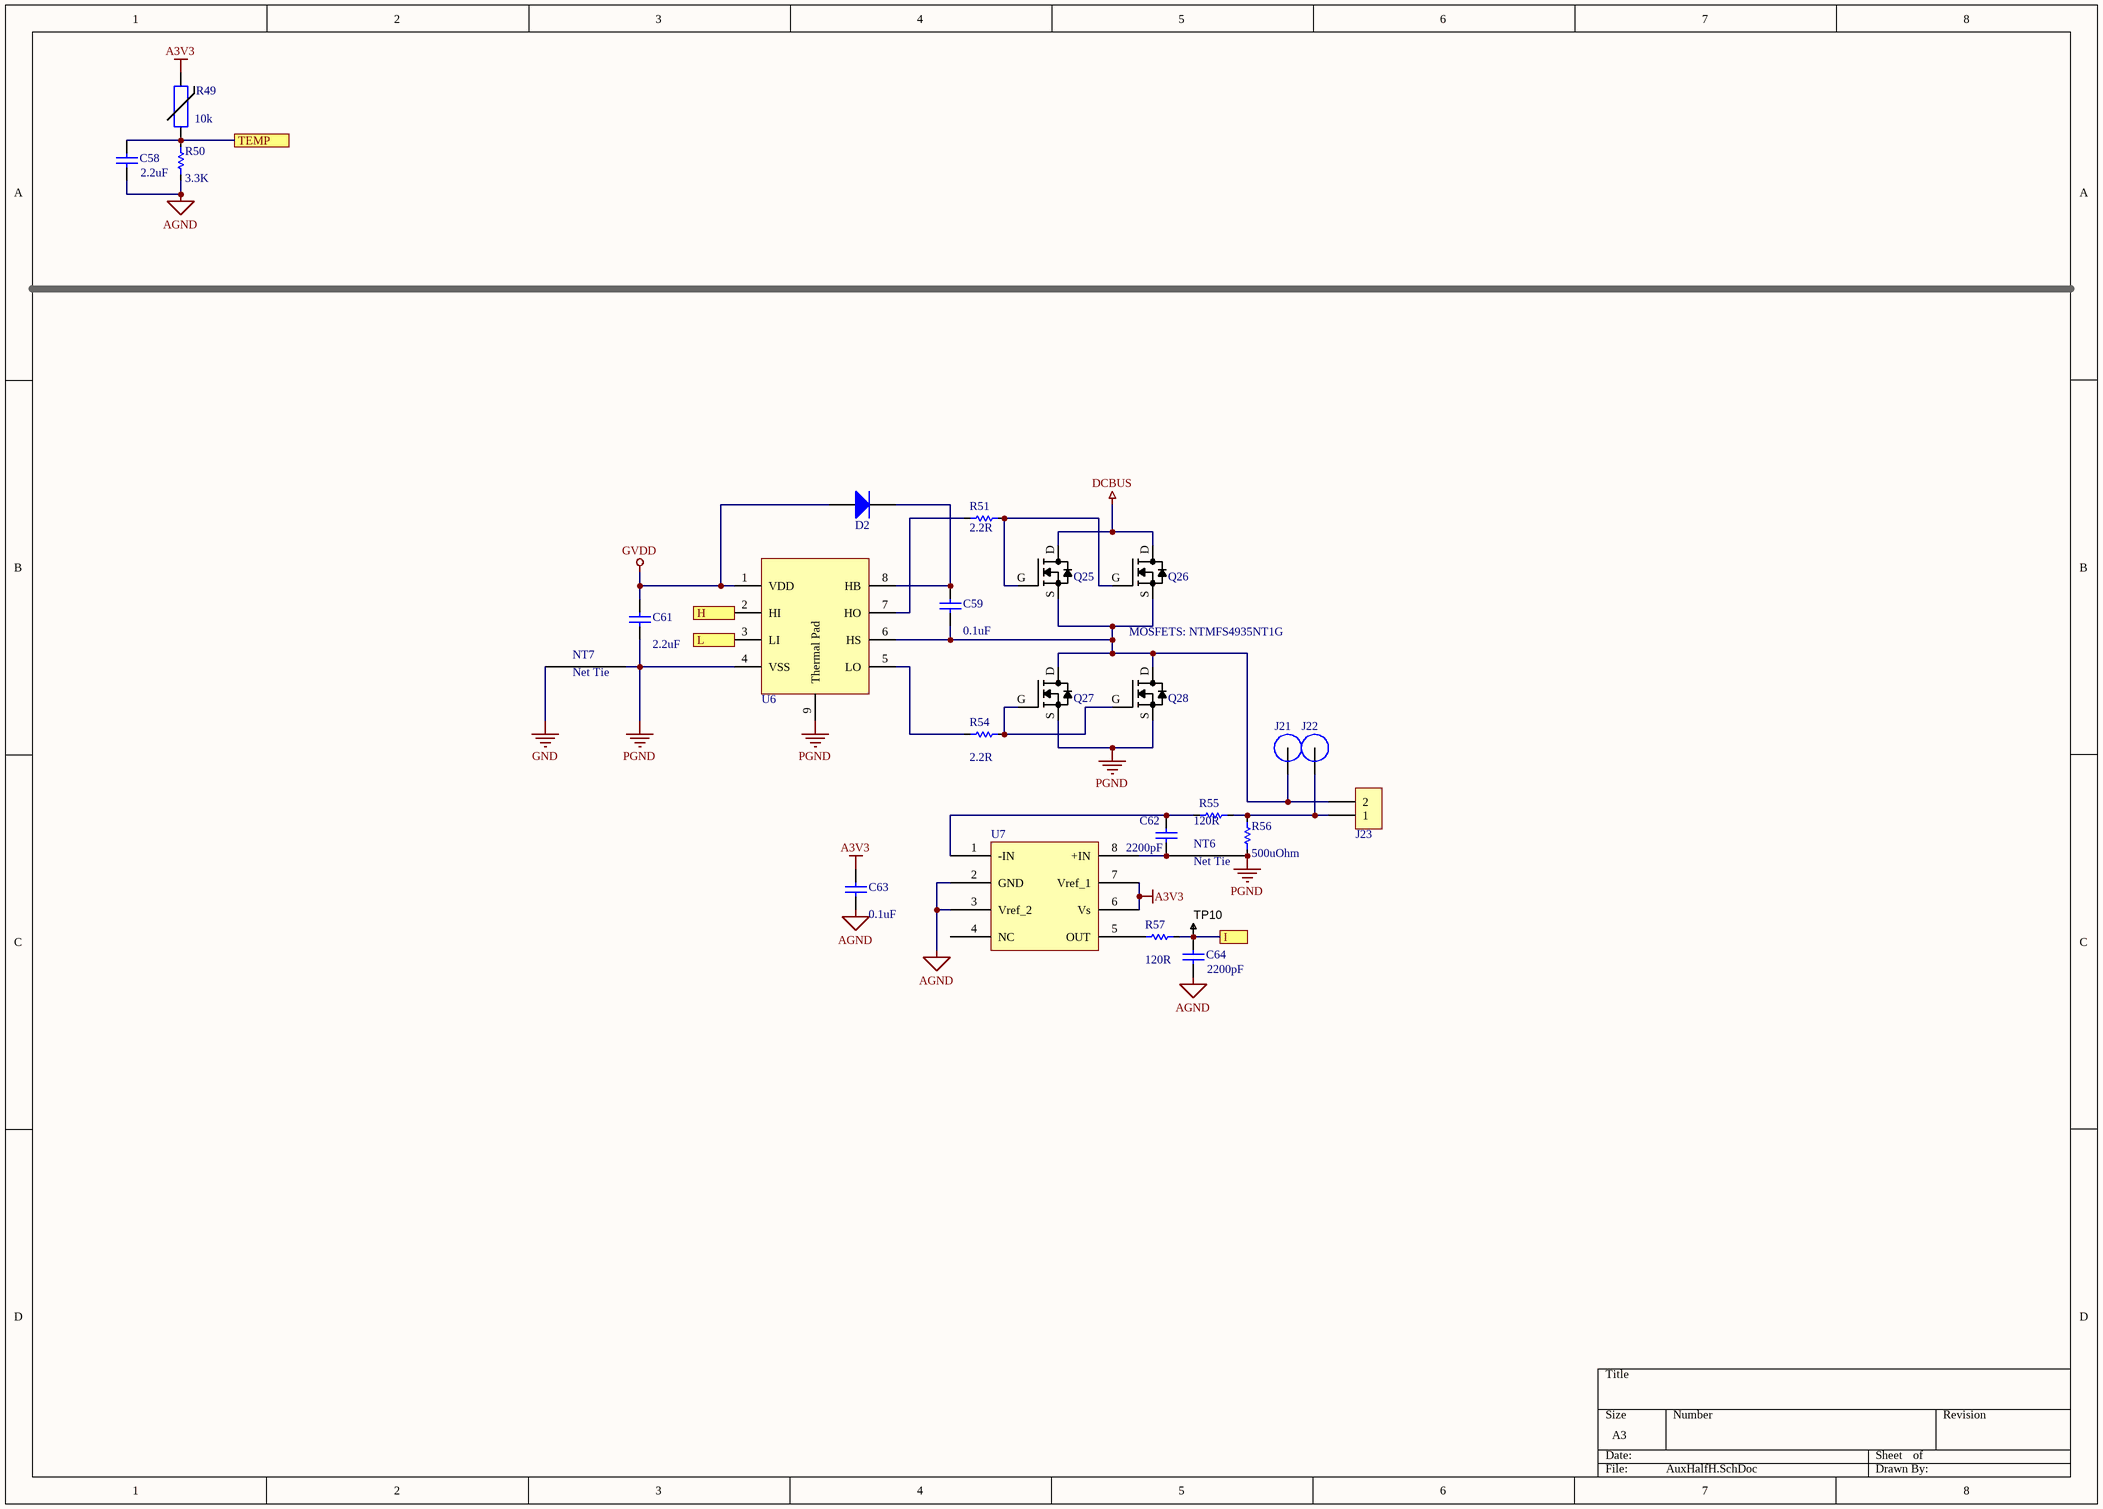
[diagram p3: AuxHalfH.SchDoc]

### Parts
C58  value 2.2uF  [C0603]  (hidden comment: Cap)
C59  value 0.1uF  [C0603]  (hidden comment: Cap)
C61  value 2.2uF  [C0603]  (hidden comment: Cap)
C62  value 2200pF  [C0603]  (hidden comment: Cap)
C63  value 0.1uF  [C0603]  (hidden comment: Cap)
C64  value 2200pF  [C0603]  (hidden comment: Cap)
D2  (no value)  [DIOM2717X10N]
J21  (no value)  [M3 Spade Hole]
J22  (no value)  [M3 Spade Hole]
J23  1868076  [1868076]  (value not drawn)
NT6  0.25mm  [NetTie_0.25mm]  (value not drawn)  (net tie, no BOM)
NT7  0.25mm  [NetTie_0.25mm]  (value not drawn)  (net tie, no BOM)
Q25  FILL_FOOTPRINT  [SO8FL_FILL]  (value not drawn)
Q26  (no value)  [SO8FL]
Q27  (no value)  [SO8FL]
Q28  (no value)  [SO8FL]
R49  10k  [RESC1005X40N]
R50  value 3.3K  [R0603]  (hidden comment: Res)
R51  value 2.2R  [R0603]  (hidden comment: Res)
R54  value 2.2R  [R0603]  (hidden comment: Res)
R55  value 120R  [R0603]  (hidden comment: Res)
R56  value 500uOhm  [R2512]  (hidden comment: Res)
R57  value 120R  [R0603]  (hidden comment: Res)
TP10  TESTPOINT  [TP-R30]  (value not drawn)  (no BOM)
U6  (no value)  [SON80P400X80_HS-9N]
U7  (no value)  [SOIC127P600X175-8N]

### Ports
H, I, L, TEMP

### Nets
A3V3: C63.2 R49.2 U7.6(Vs) U7.7(Vref_1)
AGND: C58.1 C63.1 C64.1 R50.1 U7.2(GND) U7.3(Vref_2)
DCBUS: Q25.D Q26.D
GND: NT7.1
GVDD: C61.2 D2.A U6.1(VDD)
PGND: C61.1 NT6.2 NT7.2 Q27.S Q28.S R56.1 U6.4(VSS) U6.9(Thermal_Pad)
AUX_H: U6.2(HI) ; port H
AUX_I: C64.2 R57.2 TP10.1 ; port I
AUX_L: U6.3(LI) ; port L
AUX_TEMP: C58.2 R49.1 R50.2 ; port TEMP
NetC59_1: C59.1 J21.1 J23.2 Q25.S Q26.S Q27.D Q28.D U6.6(HS)
NetC59_2: C59.2 D2.K U6.8(HB)
NetC62_1: C62.1 NT6.1 U7.8(+IN)
NetC62_2: C62.2 R55.2 U7.1(-IN)
NetJ22_1: J22.1 J23.1 R55.1 R56.2
NetQ25_G: Q25.G Q26.G R51.1
NetQ27_G: Q27.G Q28.G R54.1
NetR51_2: R51.2 U6.7(HO)
NetR54_2: R54.2 U6.5(LO)
NetR57_1: R57.1 U7.5(OUT)

Not connected (* = marked no-connect by the designer): U7 4(NC)

### Notes on the sheet
- MOSFETS: NTMFS4935NT1G
- (in symbol NetTie_0.25mm) Net Tie

### Library data of the parts
C58 C61 = Cap: CAP CER 2.2UF 16V X5R 0603; Published: 8-Jun-2000; LatestRevisionDate: 17-Jul-2002; LatestRevisionNote: Re-released for DXP Platform.; PackageReference: RAD-0.3; Publisher: Altium Limited; PackageDescription: Radial Cap, Thru-Hole; 2 Leads; 0.3 in Pin Spacing
C59 C63 = Cap: CAP CER 0.1UF 50V X7R 0603; Published: 8-Jun-2000; LatestRevisionDate: 17-Jul-2002; LatestRevisionNote: Re-released for DXP Platform.; PackageReference: RAD-0.3; Publisher: Altium Limited; PackageDescription: Radial Cap, Thru-Hole; 2 Leads; 0.3 in Pin Spacing
C62 C64 = Cap: CAP CER 2200PF 50V NP0 0603; Published: 8-Jun-2000; LatestRevisionDate: 17-Jul-2002; LatestRevisionNote: Re-released for DXP Platform.; PackageReference: RAD-0.3; Publisher: Altium Limited; PackageDescription: Radial Cap, Thru-Hole; 2 Leads; 0.3 in Pin Spacing
D2 = MBR140SFT1G: as D1 on sheet MotorCell
J21 J22 = M3 Spade Terminal
J23 = 1868076: CONN TERM BLOCK 2POS 7.62MM; Manufacturer: Phoenix Contact; Number of Levels: 1; Positions Per Level: 2; Pitch: 0.300" (7.62mm); Mating Orientation: Horizontal with Board; Current: 30A; Voltage: 300V; Wire Gauge: 10-30 AWG; Wire Termination: Screw - Rising Cage Clamp; Torque - Screw: 0.5-0.6 Nm (4.4-5.3 Lb-In); Screw Thread: M3; Supplier 1: Digi-Key; Supplier Part Number 1: 277-5840-ND; RoHS: RoHS Compliant; Category: Connectors, Interconnects; Stock: 2175; Pricing 1: 1=1.56, 10=1.517, 50=1.4178, 100=1.3044, 250=1.20512, 500=1.14842, 1000=1.0564 (USD); Packaging: Bulk; Part Status: Active; Mounting Type: Through Hole; Features: Interlocking (Side); Color: Green; Operating Temperature: -; Housing Material: Polyamide (PA), Nylon; Contact Material - Plating: -; Clamp Material - Plating: -; Screw Material - Plating: -; ComponentLink1URL: http://media.digikey.com/PDF/Data%20Sheets/Phoenix%20Contact%20PDFs/1868076.pdf; ComponentLink1Description: http://media.digikey.com/PDF/Data%20Sheets/Phoenix%20Contact%20PDFs/1868076.pdf
NT6 NT7 = NetTie_0.25mm
Q25-Q28 = NTMFS4935NT1G: as Q1 on sheet MotorCell; Supplier 1: Digi-Key; Supplier Part Number 1: NTMFS4935NT1GOSCT-ND; RoHS: RoHS Compliant; Category: Discrete Semiconductor Products; Stock 1: 932; Pricing 1: 1=0.61, 10=0.541, 100=0.4145, 500=0.3277 (USD); Packaging: Cut Tape (CT); Part Status: Active; Technology: MOSFET (Metal Oxide); Drain to Source Voltage (Vdss): 30V; FET Feature: -; Operating Temperature: -55°C ~ 150°C (TJ); Mounting Type: Surface Mount; Supplier Device Package: 5-DFN (5x6) (8-SOFL); Package / Case: 8-PowerTDFN, 5 Leads; ComponentLink1URL: http://www.onsemi.com/pub_link/Collateral/NTMFS4935N-D.PDF; ComponentLink1Description: http://www.onsemi.com/pub_link/Collateral/NTMFS4935N-D.PDF; Manufacturer Part Number: NTMFS4935NT1G
R49 = NCP15XH103F03RC: THERMISTOR 10K OHM NTC 0402 SMD; Value: 10k
R50 R51 R54 R55 R57 = Res: Resistor; Published: 8-Jun-2000; LatestRevisionDate: 17-Jul-2002; LatestRevisionNote: Re-released for DXP Platform.; PackageReference: AXIAL-0.3; Publisher: Altium Limited; PackageDescription: Axial Device, Thru-Hole; 2 Leads; 0.3 in Pin Spacing
R56 = Res: RES SMD 0.0005 OHM 1% 3W 2512; Published: 8-Jun-2000; LatestRevisionDate: 17-Jul-2002; LatestRevisionNote: Re-released for DXP Platform.; PackageReference: AXIAL-0.3; Publisher: Altium Limited; PackageDescription: Axial Device, Thru-Hole; 2 Leads; 0.3 in Pin Spacing
TP10 = TESTPOINT: SMD test pin
U6 = LM5109BSD/NOPB: DRIVER, MOSFET, HALF BRIDGE, WSON-8, 1A; Supplier 1: Farnell; Supplier Part Number 1: 2400642RL; Supplier 2: Farnell; Supplier Part Number 2: 2400642; Supplier 3: Farnell; Supplier Part Number 3: 2382850
U7 = AD8418WBRZ: ANALOG DEVICES Current Sense Amplifier, Bidirectional, 1, 130 µA, NSOIC

## Nets that join several sheets
3V3: Top (25 pins), MotorCell (U4.49), MotorCell_noPow (U5.49)
5V: Top (6 pins), MotorCell (C29.1 L2.2 R16.1)
A3V3: Top (7 pins), MotorCell (R12.2 U4.24), MotorCell_noPow (R31.2 U5.24), AuxHalfH (C63.2 R49.2 U7.6 U7.7)
AGND: Top (9 pins), MotorCell (7 pins), MotorCell_noPow (7 pins), AuxHalfH (6 pins)
DCBUS: Top (10 pins), MotorCell (14 pins), MotorCell_noPow (10 pins), AuxHalfH (Q25.D Q26.D)
GND: Top (33 pins), MotorCell (12 pins), MotorCell_noPow (5 pins), AuxHalfH (NT7.1)
GVDD: MotorCell (C32.2 U4.13), MotorCell_noPow (C47.2 U5.13), AuxHalfH (C61.2 D2.A U6.1)
PGND: Top (9 pins), MotorCell (9 pins), MotorCell_noPow (9 pins), AuxHalfH (8 pins)
AUX_H: Top (U2.30), AuxHalfH (U6.2)
AUX_I: Top (U2.21), AuxHalfH (C64.2 R57.2 TP10.1)
AUX_L: Top (U2.29), AuxHalfH (U6.3)
AUX_TEMP: Top (U2.24), AuxHalfH (C58.2 R49.1 R50.2)
EN_GATE: Top (U2.33), MotorCell (U4.16), MotorCell_noPow (U5.16)
M0_AH: Top (U2.41), MotorCell (U4.17)
M0_AL: Top (U2.34), MotorCell (U4.18)
M0_BH: Top (U2.42), MotorCell (U4.19)
M0_BL: Top (U2.35), MotorCell (U4.20)
M0_CH: Top (U2.43), MotorCell (U4.21)
M0_CL: Top (U2.36), MotorCell (U4.22)
M0_DC_CAL: Top (U2.40), MotorCell (U4.12)
M0_nCS: Top (U2.2), MotorCell (U4.8)
M0_SO1: Top (U2.8), MotorCell (C38.2 R26.1 TP6.1)
M0_SO2: Top (U2.9), MotorCell (C39.2 R29.1 TP7.1)
M0_TEMP: Top (U2.25), MotorCell (C23.2 R12.1 R13.2)
M1_AH: Top (U2.37), MotorCell_noPow (U5.17)
M1_AL: Top (U2.23), MotorCell_noPow (U5.18)
M1_BH: Top (U2.38), MotorCell_noPow (U5.19)
M1_BL: Top (U2.26), MotorCell_noPow (U5.20)
M1_CH: Top (U2.39), MotorCell_noPow (U5.21)
M1_CL: Top (U2.27), MotorCell_noPow (U5.22)
M1_DC_CAL: Top (U2.4), MotorCell_noPow (U5.12)
M1_nCS: Top (U2.3), MotorCell_noPow (U5.8)
M1_SO1: Top (U2.11), MotorCell_noPow (C53.2 R44.1 TP8.1)
M1_SO2: Top (U2.10), MotorCell_noPow (C54.2 R47.1 TP9.1)
M1_TEMP: Top (U2.20), MotorCell_noPow (C43.2 R31.1 R35.2)
nFAULT: Top (U2.54), MotorCell (U4.6), MotorCell_noPow (U5.6)
SPI_MISO: Top (J3.9 U2.52), MotorCell (U4.10), MotorCell_noPow (U5.10)
SPI_MOSI: Top (J3.10 U2.53), MotorCell (U4.9), MotorCell_noPow (U5.9)
SPI_SCK: Top (J3.8 U2.51), MotorCell (U4.11), MotorCell_noPow (U5.11)

## Assembly variants
48V: alternate parts C11 -> EEH-ZC1H121P, C12 -> EEH-ZC1H121P, C17 -> EEH-ZC1H121P, C16 -> EEH-ZC1H121P, C15 -> EEH-ZC1H121P, C14 -> EEH-ZC1H121P, C18 -> EEH-ZC1H121P, C13 -> EEH-ZC1H121P, C19 -> Cap, C21 -> Cap, C26 -> Cap, C55 -> Cap, C40 -> Cap, C60 -> Cap, C44 -> Cap, C20 -> Cap, Q25 -> NTMFS5C628NLT, Q1 -> NTMFS5C628NLT, Q2 -> NTMFS5C628NLT, Q3 -> NTMFS5C628NLT, Q4 -> NTMFS5C628NLT, Q5 -> NTMFS5C628NLT, Q6 -> NTMFS5C628NLT, Q7 -> NTMFS5C628NLT, Q8 -> NTMFS5C628NLT, Q9 -> NTMFS5C628NLT, Q10 -> NTMFS5C628NLT, Q11 -> NTMFS5C628NLT, Q12 -> NTMFS5C628NLT, Q13 -> NTMFS5C628NLT, Q14 -> NTMFS5C628NLT, Q15 -> NTMFS5C628NLT, Q16 -> NTMFS5C628NLT, Q17 -> NTMFS5C628NLT, Q18 -> NTMFS5C628NLT, Q19 -> NTMFS5C628NLT, Q20 -> NTMFS5C628NLT, Q21 -> NTMFS5C628NLT, Q22 -> NTMFS5C628NLT, Q23 -> NTMFS5C628NLT, Q24 -> NTMFS5C628NLT, Q26 -> NTMFS5C628NLT, Q27 -> NTMFS5C628NLT, Q28 -> NTMFS5C628NLT, R6 -> Res
noCAN: not fitted R5 U1